# Altium project SCB.PrjPCB (part 2 of 8)

## Sheet SCB_CLKs.SchDoc: SCB_CLKs
size A3 portrait; PageSetup: Record=PageOptions|CenterHorizontal=True|CenterVertical=True|PrintScale=1.00|XCorrection=1.00|YCorrection=1.00|PrintKind=1|BorderSize=5000000|LeftOffset=0|BottomOffset=0|Orientation=1|PaperLength=1000|PaperWidth=1000|Scale=100|PaperSource=7|PrintQuality=-4|MediaType=1|DitherType=10|PaperKind=A4|PrintScaleMode=1; Revision: 3.4; SheetNumber: 3; SheetTotal: 23; Date: 18/06/2014; DrawnBy: J. Gabriel R.E.; Organization: Seven Solutions S.L.; Address1: C/Baza, Parcela 19, Nave 3; Address2: Polígono Ind. Juncaril; Address3: 18210-Peligros-Granada; Address4: Spain; WebAddress: www.sevensols.com; Project: White Rabbit; ProjectName: White Rabbit
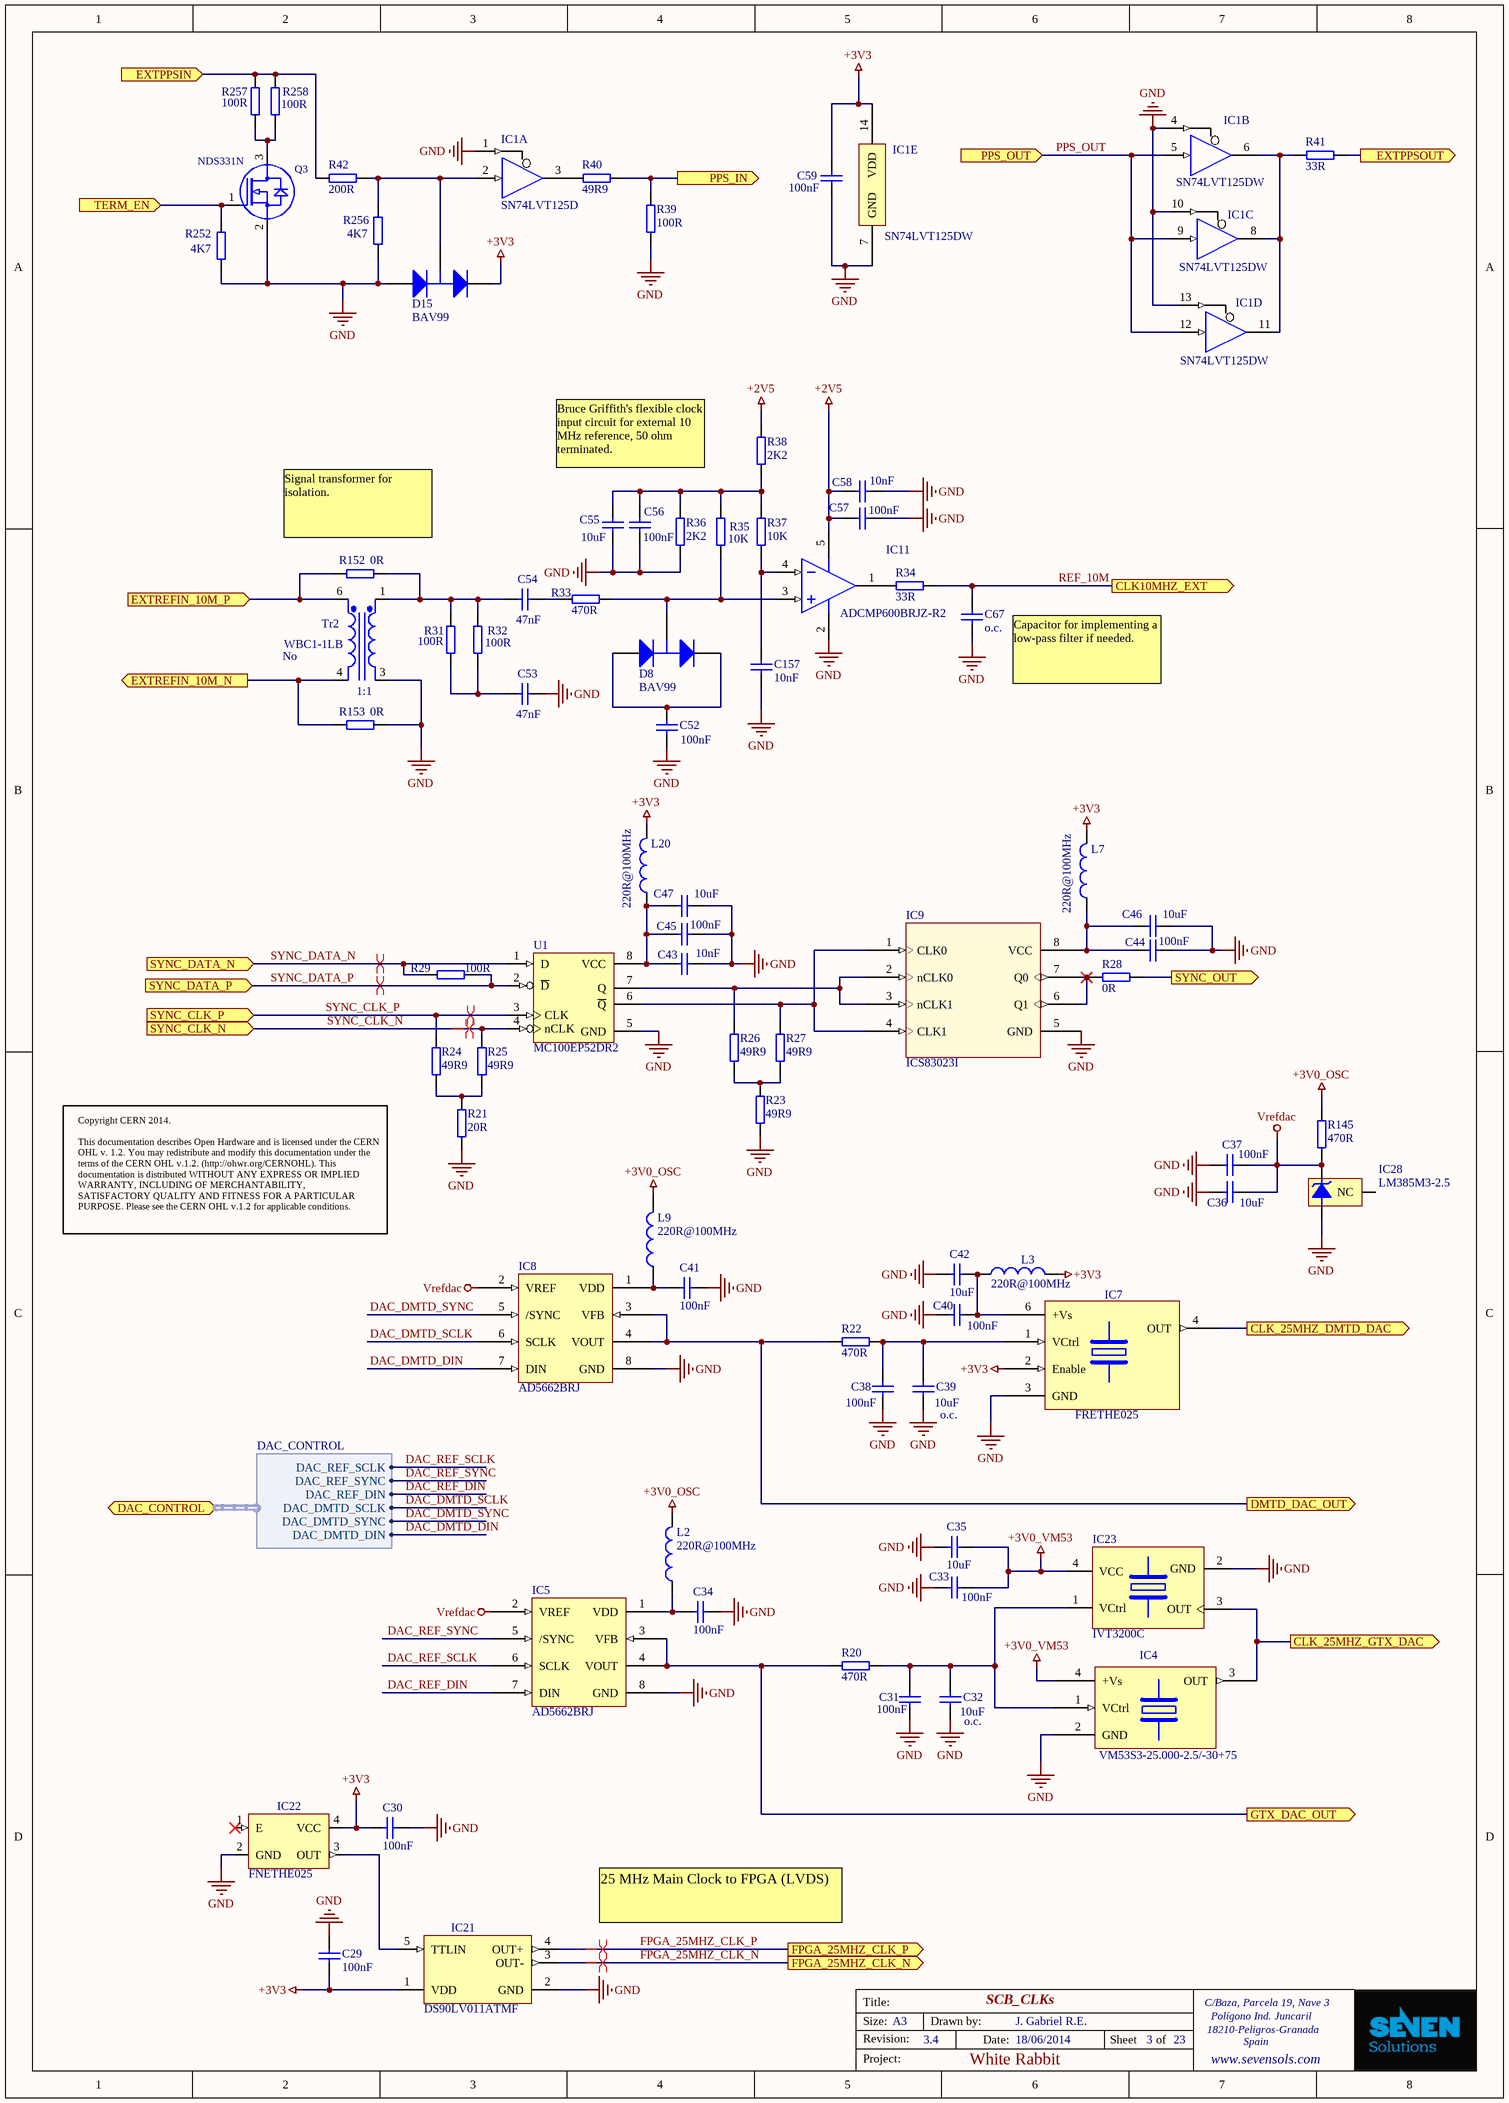
[diagram p5: SCB_CLKs.SchDoc]

### Parts
C29  100nF  [CC1005-0402]
C30  100nF  [CC1005-0402]
C31  100nF  [CC1005-0402]
C32  10uF  value o.c.  [CC1608-0603]
C33  100nF  [CC1005-0402]
C34  100nF  [CC1005-0402]
C35  10uF  [CC1608-0603]
C36  10uF  [CC1608-0603]
C37  100nF  [CC1005-0402]
C38  100nF  [CC1005-0402]
C39  10uF  value o.c.  [CC1608-0603]
C40  100nF  [CC1005-0402]
C41  100nF  [CC1005-0402]
C42  10uF  [CC1608-0603]
C43  10nF  [CC1005-0402]
C44  100nF  [CC1005-0402]
C45  100nF  [CC1005-0402]
C46  10uF  [CC1608-0603]
C47  10uF  [CC1608-0603]
C52  100nF  [CC1005-0402]
C53  47nF  [CC1005-0402]
C54  47nF  [CC1005-0402]
C55  10uF  [CC1608-0603]
C56  100nF  [CC1005-0402]
C57  100nF  [CC1005-0402]
C58  10nF  [CC1005-0402]
C59  100nF  [CC1005-0402]
C67  o.c.  [CC1608-0603]
C157  10nF  [CC1005-0402]
D8  BAV99  [SOT-23]
D15  BAV99  [SOT-23]
IC1  SN74LVT125D  [SO-14]  (parts A,B,C,D,E of 5)
IC4  VM53S3-25.000-2.5/-30+75  [VCTCXO_VM53S]
IC5  value AD5662BRJ  [SOT23-8]  (hidden comment: AD5662B)
IC7  FRETHE025  [vs-705]
IC8  value AD5662BRJ  [SOT23-8]  (hidden comment: AD5662B)
IC9  ICS83023I  [SOIC127P600X175-8N]
IC11  ADCMP600BRJZ-R2  [SOT23-5AL]
IC21  DS90LV011ATMF  [MF05A_N]
IC22  FNETHE025  [SPXO]
IC23  IVT3200C  [OSC_RAKON_IVT3200C]
IC28  LM385M3-2.5  [MF03A_N]
L2  Impedance: 220R@100MHz  [0603]  (hidden comment: 220R@100MHz Ferrite Bead)
L3  Impedance: 220R@100MHz  [0603]  (hidden comment: 220R@100MHz Ferrite Bead)
L7  Impedance: 220R@100MHz  [0603]  (hidden comment: 220R@100MHz Ferrite Bead)
L9  Impedance: 220R@100MHz  [0603]  (hidden comment: 220R@100MHz Ferrite Bead)
L20  Impedance: 220R@100MHz  [0603]  (hidden comment: 220R@100MHz Ferrite Bead)
Q3  NDS331N  [SOT23-3]
R20  470R  [0402]
R21  20R  [0603]
R22  470R  [0402]
R23  49R9  [0402]
R24  49R9  [0402]
R25  49R9  [0402]
R26  49R9  [0402]
R27  49R9  [0402]
R28  value 0R  [0402]  (hidden comment: Jumper)
R29  100R  [0402]
R31  100R  [0805]
R32  100R  [0805]
R33  470R  [0402]
R34  33R  [0603]
R35  10k  [0402]
R36  2K2  [0402]
R37  10k  [0402]
R38  2K2  [0402]
R39  100R  [0402]
R40  49R9  [0603]
R41  33R  [0603]
R42  200R  [0402]
R145  470R  [0402]
R152  value 0R  [0402]  (hidden comment: Jumper)
R153  value 0R  [0402]  (hidden comment: Jumper)
R252  4K7  [0402]
R256  4K7  [0402]
R257  100R  [0805]
R258  100R  [0805]
Tr2  WBC1-1LB  value 1:1  Mounted: No  [SMT6P150P]
U1  MC100EP52DR2  [TSOP65P490-8AN]

### Ports
CLK10MHZ_EXT (out), CLK_25MHZ_DMTD_DAC (out), CLK_25MHZ_GTX_DAC (out), DAC_CONTROL (harness DAC_CONTROL), DMTD_DAC_OUT (out), EXTPPSIN (in), EXTPPSOUT (out), EXTREFIN_10M_N (out), EXTREFIN_10M_P (in), FPGA_25MHZ_CLK_N (out), FPGA_25MHZ_CLK_P (out), GTX_DAC_OUT (out), PPS_IN (out), PPS_OUT (in), SYNC_CLK_N (in), SYNC_CLK_P (in), SYNC_DATA_N (in), SYNC_DATA_P (in), SYNC_OUT (out), TERM_EN (in)

### Harnesses
DAC_CONTROL: DAC_DMTD_DIN, DAC_DMTD_SYNC, DAC_DMTD_SCLK, DAC_REF_DIN, DAC_REF_SYNC, DAC_REF_SCLK

### Nets
+2V5: C57.2 C58.2 IC11.5(VCC/VCCO) R38.2
+3V0_OSC: L2.2 L9.2 R145.2
+3V0_VM53: C33.1 C35.1 IC4.4(+Vs) IC23.4(VCC)
+3V3: C29.2 C30.2 C59.2 D15.2(K) IC1.14(VDD) IC7.2(Enable) IC21.1(VDD) IC22.4(VCC) L3.2 L7.2 L20.2
GND: C29.1 C30.1 C31.1 C32.1 C33.2 C34.1 C35.2 C36.1 C37.2 C38.1 C39.1 C40.2 C41.1 C42.2 C43.2 C44.1 C45.1 C46.1 C47.1 C52.1 C53.2 C55.1 C56.1 C57.1 C58.1 C59.1 C67.1 C157.2 D15.1(A) IC1.1(~{A}) IC1.4(~{A}) IC1.7(GND) IC1.10(~{A}) IC1.13(~{A}) IC4.2(GND) IC5.8(GND) IC7.3(GND) IC8.8(GND) IC9.5(GND) IC11.2(VEE) IC21.2(GND) IC22.2(GND) IC23.2(GND) IC28.2(-V) Q3.2(SOURCE) R21.1 R23.2 R36.1 R39.1 R153.1 R252.2 R256.2 Tr2.3(Sec-) U1.5(GND)
Vrefdac: C36.2 C37.1 IC5.2(VREF) IC8.2(VREF) IC28.1(+V) R145.1
DAC_DMTD_DIN: IC8.7(DIN) ; port DAC_CONTROL.DAC_DMTD_DIN  [project net DAC_CONTROL.DAC_DMTD_DIN]
DAC_DMTD_SCLK: IC8.6(SCLK) ; port DAC_CONTROL.DAC_DMTD_SCLK  [project net DAC_CONTROL.DAC_DMTD_SCLK]
DAC_DMTD_SYNC: IC8.5(/SYNC) ; port DAC_CONTROL.DAC_DMTD_SYNC  [project net DAC_CONTROL.DAC_DMTD_SYNC]
DAC_REF_DIN: IC5.7(DIN) ; port DAC_CONTROL.DAC_REF_DIN  [project net DAC_CONTROL.DAC_REF_DIN]
DAC_REF_SCLK: IC5.6(SCLK) ; port DAC_CONTROL.DAC_REF_SCLK  [project net DAC_CONTROL.DAC_REF_SCLK]
DAC_REF_SYNC: IC5.5(/SYNC) ; port DAC_CONTROL.DAC_REF_SYNC  [project net DAC_CONTROL.DAC_REF_SYNC]
EXTREFIN_10M_N: R153.2 Tr2.4(Pri-) ; port EXTREFIN_10M_N
EXTREFIN_10M_P: R152.2 Tr2.6(Pri+) ; port EXTREFIN_10M_P
FPGA_25MHZ_CLK_N: IC21.3(OUT-) ; port FPGA_25MHZ_CLK_N
FPGA_25MHZ_CLK_P: IC21.4(OUT+) ; port FPGA_25MHZ_CLK_P
PPS_OUT: IC1.5(B) IC1.9(B) IC1.12(B) ; port PPS_OUT
REF_10M: C67.2 R34.2 ; port CLK10MHZ_EXT  [project net CLK10MHZ_EXT]
SYNC_CLK_N: R25.1 U1.4(nCLK) ; port SYNC_CLK_N
SYNC_CLK_P: R24.1 U1.3(CLK) ; port SYNC_CLK_P
SYNC_DATA_N: R29.1 U1.1(D) ; port SYNC_DATA_N
SYNC_DATA_P: R29.2 U1.2(~{D}) ; port SYNC_DATA_P
NetC31_2: C31.2 C32.2 IC4.1(VCtrl) IC23.1(VCtrl) R20.2
NetC34_2: C34.2 IC5.1(VDD) L2.1
NetC38_2: C38.2 C39.2 IC7.1(VCtrl) R22.2
NetC40_1: C40.1 C42.1 IC7.6(+Vs) L3.1
NetC41_2: C41.2 IC8.1(VDD) L9.1
NetC43_1: C43.1 C45.2 C47.2 L20.1 U1.8(VCC)
NetC44_2: C44.2 C46.2 IC9.8(VCC) L7.1
NetC52_2: C52.2 D8.1(A) D8.2(K)
NetC53_1: C53.1 R31.1 R32.1
NetC54_1: C54.1 R31.2 R32.2 R152.1 Tr2.1(Sec+)
NetC54_2: C54.2 R33.1
NetC55_2: C55.2 C56.2 R35.2 R36.2 R37.2 R38.1
NetC154_2: IC7.4(OUT) ; port CLK_25MHZ_DMTD_DAC
NetC157_1: C157.1 IC11.4(VN) R37.1
NetC185_1: IC4.3(OUT) IC23.3(OUT) ; port CLK_25MHZ_GTX_DAC
NetD8_3: D8.3(C) IC11.3(VP) R33.2 R35.1
NetD15_3: D15.3(C) IC1.2(B) R42.1 R256.1
NetIC1_3: IC1.3(Y) R40.1
NetIC1_6: IC1.6(Y) IC1.8(Y) IC1.11(Y) R41.1
NetIC5_3: IC5.3(VFB) IC5.4(VOUT) R20.1 ; port GTX_DAC_OUT
NetIC8_3: IC8.3(VFB) IC8.4(VOUT) R22.1 ; port DMTD_DAC_OUT
NetIC9_1: IC9.1(CLK0) IC9.4(CLK1) R27.1 U1.6(~{Q})
NetIC9_2: IC9.2(nCLK0) IC9.3(nCLK1) R26.1 U1.7(Q)
NetIC9_6: IC9.6(Q1) IC9.7(Q0) R28.1
NetIC11_1: IC11.1(Q) R34.1
NetIC21_5: IC21.5(TTLIN) IC22.3(OUT)
NetIC33_AL34: Q3.1(GATE) R252.1 ; port TERM_EN
NetIC33_J25: R39.2 R40.2 ; port PPS_IN
NetP1_1: R42.2 R257.2 R258.2 ; port EXTPPSIN
NetP3_1: R28.2 ; port SYNC_OUT
NetP4_1: R41.2 ; port EXTPPSOUT
NetQ3_3: Q3.3(DRAIN) R257.1 R258.1
NetR21_2: R21.2 R24.2 R25.2
NetR23_1: R23.1 R26.2 R27.2

Not connected (* = marked no-connect by the designer): IC22 1(E)*; IC28 3(NC)

### Layout directives
differential pair: FPGA_25MHZ_CLK_N, FPGA_25MHZ_CLK_P, SYNC_CLK_N, SYNC_CLK_P, SYNC_DATA_N, SYNC_DATA_P

### Notes on the sheet
- Bruce Griffith's flexible clock input circuit for external 10 MHz reference, 50 ohm terminated.
- (near R152) Signal transformer for isolation.
- (near C67) Capacitor for implementing a low-pass filter if needed.
- Copyright CERN 2014.
  This documentation describes Open Hardware and is licensed under the CERN OHL v. 1.2. You may redistribute and modify this documentation under the terms of the CERN OHL v.1.2. (http://ohwr.org/CERNOHL). This documentation is distributed WITHOUT ANY EXPRESS OR IMPLIED WARRANTY, INCLUDING OF MERCHANTABILITY, SATISFACTORY QUALITY AND FITNESS FOR A PARTICULAR PURPOSE. Please see the CERN OHL v.1.2 for applicable conditions.
- 25 MHz Main Clock to FPGA (LVDS)
- Title:
- Size:
- Revision:
- A3
- Drawn by:
- Date:
- Sheet
- of
- Project:

### Library data of the parts
C29-C31 C33 C34 C37 C38 C40 C41 C44 C45 C52 C56 C57 C59 = CC0402_100NF_16V_10%_X7R: Capacitor; Manufacturer1: TDK; Manufacturer1 PN: C1005X7R1C104K; TC: X7R; Tolerance: ±10%; Voltage: 16V; Published: 8-Jun-2000; LatestRevisionDate: 17-Jul-2002; LatestRevisionNote: Re-released for DXP Platform.; PackageReference: RAD-0.3; Publisher: Altium Limited; Distributor1: Digikey; Distributor1 PN: 445-4952-1-ND; Case: 0402; Value: 100nF
C32 C39 = CC0603_10UF_6.3V_20%_X5R: Capacitor; Manufacturer1: TDK; Manufacturer1 PN: C1608X5R0J106M; TC: X5R; Tolerance: ±20%; Voltage: 6.3V; Mounted: No; Published: 8-Jun-2000; LatestRevisionDate: 17-Jul-2002; LatestRevisionNote: Re-released for DXP Platform.; PackageReference: RAD-0.3; Publisher: Altium Limited; Distributor1: Digikey; Distributor1 PN: 445-4112-1-ND; Case: 0603
C35 C36 C42 C46 C47 C55 = CC0603_10UF_6.3V_20%_X5R: Capacitor; Manufacturer1: TDK; Manufacturer1 PN: C1608X5R0J106M; TC: X5R; Tolerance: ±20%; Voltage: 6.3V; Published: 8-Jun-2000; LatestRevisionDate: 17-Jul-2002; LatestRevisionNote: Re-released for DXP Platform.; PackageReference: RAD-0.3; Publisher: Altium Limited; Distributor1: Digikey; Distributor1 PN: 445-4112-1-ND; Case: 0603; Value: 10uF
C43 C58 C157 = CC0402_10NF_25V_10%_X7R: Capacitor; Manufacturer1: TDK; Manufacturer1 PN: C1005X7R1E103K; TC: X7R; Tolerance: ±10%; Voltage: 25V; Published: 8-Jun-2000; LatestRevisionDate: 17-Jul-2002; LatestRevisionNote: Re-released for DXP Platform.; PackageReference: RAD-0.3; Publisher: Altium Limited; Distributor1: Digikey; Distributor1 PN: 445-1260-1-ND; Case: 0402; Value: 10nF
C53 C54 = CC0402_47NF_25V_10%_X7R: Capacitor; Manufacturer1: TDK; Manufacturer1 PN: C1005X7R1E473K; TC: X7R; Tolerance: ±10%; Voltage: 25V; Published: 8-Jun-2000; LatestRevisionDate: 17-Jul-2002; LatestRevisionNote: Re-released for DXP Platform.; PackageReference: RAD-0.3; Publisher: Altium Limited; Distributor1: Digikey; Distributor1 PN: 445-4941-1-ND; Case: 0402; Value: 47nF
C67 = CC0603_O.C.: Capacitor; Manufacturer1: Phycomp; TC: X7R; Tolerance: ±10%; Voltage: 16V; Mounted: No; Published: 8-Jun-2000; LatestRevisionDate: 17-Jul-2002; LatestRevisionNote: Re-released for DXP Platform.; PackageReference: RAD-0.3; Publisher: Altium Limited; Manufacturer1 PN: *; Distributor1: Digikey; Distributor1 PN: *; Case: 0402; Value: o.c.
D8 D15 = BAV99: Silicon Switching Diode Array for High-Speed Switching; RefId: 1081211; Published: 21-Mar-2003; DatasheetDocument: Oct-1999; PackageDocument: Sep-2001; PackageReference: SOT-23; Publisher: Altium Limited; ComponentLink1Description: Manufacturer Link; ComponentLink1URL: http://www.infineon.com/; ComponentLink2Description: Datasheet; ComponentLink2URL: http://www.infineon.com/upload/Document/cmc_upload/documents/080/631/bav99series_1.pdf; Supplier: Farnell; Value: BAV99
IC1 = SN74LVT125: Quad Buffer with 3-State Outputs with TTL Compatible Inputs; Value: SN74LVT125D; Distributor1 PN: 9592849; Distributor1: Farnell
IC4 = VCTCXO_VM53S: VCTCXO oscillator; Manufacturer1: MEC; Distributor1: RS; Distributor1 PN: 672-0797
IC5 IC8 = AD5662BRJ: Analog Devices 16-bit DAC w/SPI interface, ext ref; RefId: AD5662BRJZ-2REEL7DKR-ND; Supplier: Digikey
IC7 = VCXO_CFPV_45: VCXO oscillator; Manufacturer: Pericom; Distributor1: Digikey; Distributor1 PN: FRETHE025-ND; Manufacturer PN: FRETHE025
IC9 = ICS83023I: 350MHz Differential-to-LVCMOS Translator/Buffer; Manufacturer1 PN: ICS83023AMILF; Manufacturer1: IDT; Distributor1: Digikey; Distributor1 PN: 800-1102-5-ND
IC11 = ADCMP600: Analog Devices fast comparator; Distributor1: Digikey; Distributor1 PN: ADCMP600BRJZ-REEL7CT-ND; Manufacturer1 PN: ADCMP600BRJZ-R2; Manufacturer1: Analog Devices
IC21 = DS90LV011ATMF: Single High Speed Differential Driver; Manufacturer: National Semiconductor; CompType: Interface IC; PackageTopMarking: N01*XTT; PowerWise: N; Published: 4-Dec-2008; DatasheetVersion: May-2002; PackageVersion: revD, Aug-2008; PackageReference: MF05A; Publisher: Altium Limited; PackageDescription: Molded SOT-23, .115 x .063 x .040in Body, 5 Lead, .0375in Pitch; PartNumber: DS90LV011ATMF; RoHS: O; PinCount: 5; DigiKeyPartNumber: DS90LV011ATMFTR-ND; ComponentLink1Description: DS90LV011A Datasheet; ComponentLink1URL: http://www.national.com/ds/DS/DS90LV011A.pdf; ComponentLink2Description: DS90LV011A Web Page; ComponentLink2URL: http://www.national.com/pf/DS/DS90LV011A.html; ComponentLink3Description: MF05A Package Page; ComponentLink3URL: http://www.national.com/packaging/folders/mf05a.html
IC22 = OSC_CFPS-73: SMD oscillator 3.3V (Elfa); Value: FNETHE025; Distributor: Digikey; Distributor PN: FNETHE025CT-ND
IC23 = IVT32000C
IC28 = LM385M3-2.5: Micropower Voltage Reference Diode; Manufacturer: National Semiconductor; CompType: Voltage Reference IC; PackageTopMarking: R12*XTT; Published: 4-Dec-2008; DatasheetVersion: Jan-2008; PackageVersion: revB, Mar-2003; PackageReference: MF03A; Publisher: Altium Limited; PackageDescription: Molded SOT-23, .115 x .051 x .037in Body, 3 Lead, .075 in Pitch; PartNumber: LM385M3-2.5; RoHS: O; PinCount: 3; DigiKeyPartNumber: LM385M3-2.5CT-ND; ComponentLink1Description: LM385-2.5 Datasheet; ComponentLink1URL: http://www.national.com/ds/LM/LM385-2.5.pdf; ComponentLink2Description: LM385-2.5 Web Page; ComponentLink2URL: http://www.national.com/pf/LM/LM385-2.5.html; ComponentLink3Description: MF03A Package Page; ComponentLink3URL: http://www.national.com/packaging/folders/mf03a.html
L2 L3 L7 L9 L20 = L_FERRITE_BEAD: ferrite bead; Manufacturer1: Murata; Manufacturer1 PN: BLM18KG221SN1D; Current Rating: 2.2A; DCR: 50mOhm; Case: 0603; Distributor1: Digikey; Distributor1 PN: 490-5255-1-ND
Q3 = NDS331N: N-Channel Logic Level Enhancement Mode Field Effect Transistor; DEVICE: NDS331N; VALUE: NDS331N; Distributor1 PN: NDS331NCT-ND; Distributor1: Digikey
R20 R22 R33 R145 = R0402_470R_±1%_0.1W_100PPM: SMD Resistor; Manufacturer1: Panasonic; Manufacturer1 PN: ERJ-2RKF4700X; TCR: 100ppm; Power Rating: 0.1W; Tolerance: ±1%; Case: 0402; Distributor1: DigiKey; Distributor1 PN: P470LCT-ND; Value: 470R
R21 = R0603_20R_±1%_0.25W_100PPM: SMD Resistor; Manufacturer1: Vishay; Manufacturer1 PN: CRCW060320R0FKEAHP; TCR: 100ppm; Power Rating: 0.25W; Tolerance: ±1%; Case: 0603; Distributor1: DigiKey; Distributor1 PN: 541-20.0SCT-ND; Value: 20R
R23-R27 = R0402_49R9_±1%_0.1W_100PPM: SMD Resistor; Manufacturer1: Panasonic; Manufacturer1 PN: ERJ-2RKF49R9X; TCR: 100ppm; Power Rating: 0.1W; Tolerance: ±1%; Case: 0402; Distributor1: DigiKey; Distributor1 PN: P49.9LCT-ND; Value: 49R9
R28 R152 R153 = R0402_0R_0.1W_JUMPER: SMD Resistor; Manufacturer1: Panasonic; Manufacturer1 PN: ERJ-2GE0R00X; TCR: 100ppm; Power Rating: 0.1W; Case: 0402; Distributor1: DigiKey; Distributor1 PN: P0.0JCT-ND; Tolerance: Jumper
R29 R39 = R0402_100R_±1%_0.1W_100PPM: SMD Resistor; Manufacturer1: Panasonic; Manufacturer1 PN: ERJ-2RKF1000X; TCR: 100ppm; Power Rating: 0.1W; Tolerance: ±1%; Case: 0402; Distributor1: DigiKey; Distributor1 PN: P100LCT-ND; Value: 100R
R31 R32 R257 R258 = R0805_100R_±1%_0.33W_100PPM: SMD Resistor; Manufacturer1: Vishay Dale; Manufacturer1 PN: CRCW0805100RFKEAHP; TCR: 100ppm; Power Rating: 0.33W; Tolerance: ±1%; Case: 0805; Distributor1: DigiKey; Distributor1 PN: 541-100TCT-ND; Value: 100R
R34 R41 = R0603_33R_±1%_0.25W_100PPM: SMD Resistor; Manufacturer1: Vishay/Dale; Manufacturer1 PN: CRCW060333R0FKEAHP; TCR: 100ppm; Power Rating: 0.25W; Tolerance: ±1%; Distributor1: DigiKey; Distributor1 PN: 541-33.0SCT-ND; Value: 33R
  R34: Case: 0603
  R41: Case: 0402
R35 R37 = R0402_10K_±1%_0.1W_100PPM: SMD Resistor; Manufacturer1: Panasonic; Manufacturer1 PN: ERJ-2RKF1002X; TCR: 100ppm; Power Rating: 0.1W; Tolerance: ±1%; Case: 0402; Distributor1: DigiKey; Distributor1 PN: P10.0KLCT-ND; Value: 10K
R36 R38 = R0402_2K2_±1%_0.1W_100PPM: SMD Resistor; Manufacturer1: Panasonic; Manufacturer1 PN: ERJ-2RKF2201X; TCR: 100ppm; Power Rating: 0.1W; Tolerance: ±1%; Case: 0402; Distributor1: DigiKey; Distributor1 PN: P2.20KLCT-ND; Value: 2K2
R40 = R0603_49R9_±1%_0.25W_100PPM: SMD Resistor; Manufacturer1: Vishay/Dale; Manufacturer1 PN: CRCW060349R9FKEAHP; TCR: 100ppm; Power Rating: 0.25W; Tolerance: ±1%; Case: 0603; Distributor1: DigiKey; Distributor1 PN: 541-49.9SCT-ND; Value: 49R9
R42 = R0402_200R_±1%_0.1W_100PPM: SMD Resistor; Manufacturer1: Panasonic; Manufacturer1 PN: ERJ-2RKF2000X; TCR: 100ppm; Power Rating: 0.1W; Tolerance: ±1%; Case: 0402; Distributor1: DigiKey; Distributor1 PN: P200LCT-ND; Value: 200R
R252 R256 = R0402_4.7K_±1%_0.1W_100PPM: SMD Resistor; Manufacturer1: Panasonic; Manufacturer1 PN: ERJ-2RKF4701X; TCR: 100ppm; Power Rating: 0.1W; Tolerance: ±1%; Case: 0402; Distributor1: DigiKey; Distributor1 PN: ERJ-2RKF4701X; Value: 4K7
Tr2 = WBC1-1LB: SMT Mini WideBand Transformer 1:1, 10uH,; Manufacturer: Coilcraft; Published: 8-Jun-2000; LatestRevisionDate: 17-Jul-2002; LatestRevisionNote: Re-released for DXP Platform.; PackageReference: TRF_4; Publisher: Altium Limited; Manufacturer PN: WBC1-1LB
U1 = MC100EP52DR2: Differential Data and Clock D-Type Flip-Flop; Manufacturer1: On Semiconductors; Manufacturer1 PN: MC100EP52DTG; Distributor1: Digikey; Distributor1 PN: MC100EP52DTGOS-ND

## Sheet FPGA_GTX.SchDoc: FPGA_GTX
size A3; Date: 18/06/2014; DrawnBy: J. Gabriel R.E.; Organization: Seven Solutions S.L.; Address1: C/Baza, Parcela 19, Nave 3; Address2: Polígono Ind. Juncaril; Address3: 18210-Peligros-Granada; Address4: Spain; Revision: 3.4; SheetNumber: 7; SheetTotal: 23; WebAddress: www.sevensols.com; Project: White Rabbit; ProjectName: Project Name
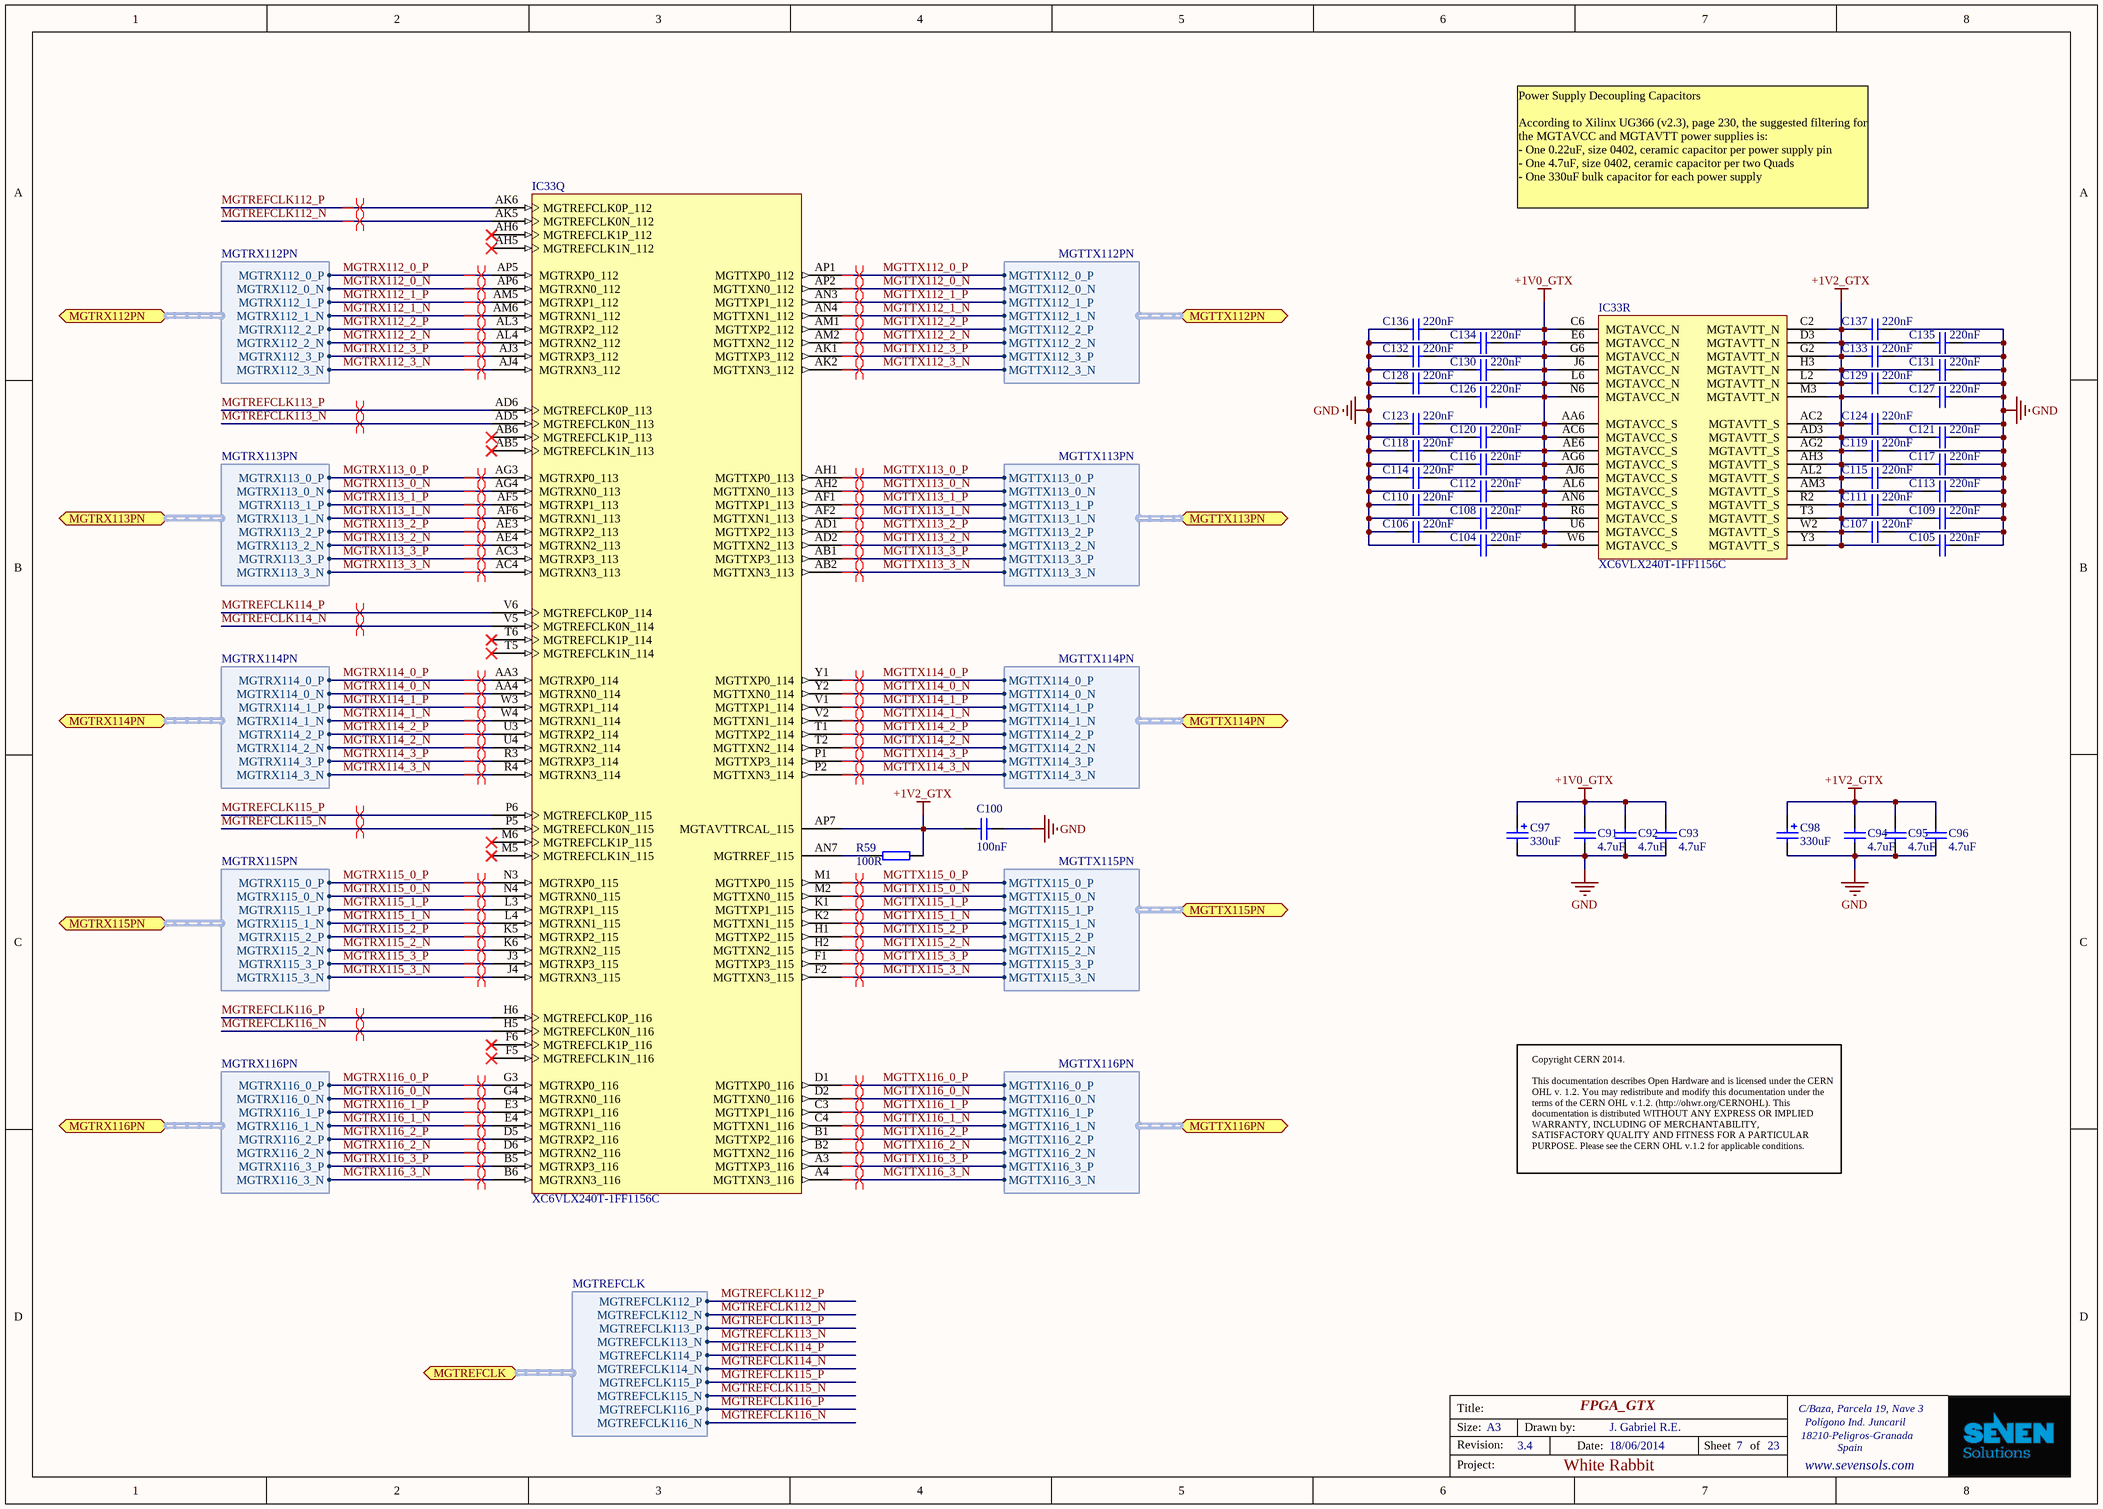
[diagram p6: FPGA_GTX.SchDoc]

### Parts
C91  4.7uF  [CC1608-0603]
C92  4.7uF  [CC1608-0603]
C93  4.7uF  [CC1608-0603]
C94  4.7uF  [CC1608-0603]
C95  4.7uF  [CC1608-0603]
C96  4.7uF  [CC1608-0603]
C97  330uF  [D]
C98  330uF  [D]
C100  100nF  [CC1005-0402]
C104  220nF  [CC1005-0402]
C105  220nF  [CC1005-0402]
C106  220nF  [CC1005-0402]
C107  220nF  [CC1005-0402]
C108  220nF  [CC1005-0402]
C109  220nF  [CC1005-0402]
C110  220nF  [CC1005-0402]
C111  220nF  [CC1005-0402]
C112  220nF  [CC1005-0402]
C113  220nF  [CC1005-0402]
C114  220nF  [CC1005-0402]
C115  220nF  [CC1005-0402]
C116  220nF  [CC1005-0402]
C117  220nF  [CC1005-0402]
C118  220nF  [CC1005-0402]
C119  220nF  [CC1005-0402]
C120  220nF  [CC1005-0402]
C121  220nF  [CC1005-0402]
C123  220nF  [CC1005-0402]
C124  220nF  [CC1005-0402]
C126  220nF  [CC1005-0402]
C127  220nF  [CC1005-0402]
C128  220nF  [CC1005-0402]
C129  220nF  [CC1005-0402]
C130  220nF  [CC1005-0402]
C131  220nF  [CC1005-0402]
C132  220nF  [CC1005-0402]
C133  220nF  [CC1005-0402]
C134  220nF  [CC1005-0402]
C135  220nF  [CC1005-0402]
C136  220nF  [CC1005-0402]
C137  220nF  [CC1005-0402]
IC33  XC6VLX240T-1FF1156C  [FF1156]  (parts Q,R of 20)
R59  100R  [0402]

### Ports
MGTREFCLK (harness MGTREFCLK), MGTRX112PN (harness MGTRX112PN), MGTRX113PN (harness MGTRX113PN), MGTRX114PN (harness MGTRX114PN), MGTRX115PN (harness MGTRX115PN), MGTRX116PN (harness MGTRX116PN), MGTTX112PN (harness MGTTX112PN), MGTTX113PN (harness MGTTX113PN), MGTTX114PN (harness MGTTX114PN), MGTTX115PN (harness MGTTX115PN), MGTTX116PN (harness MGTTX116PN)

### Harnesses
MGTREFCLK: MGTREFCLK112_P, MGTREFCLK112_N, MGTREFCLK113_P, MGTREFCLK113_N, MGTREFCLK114_P, MGTREFCLK114_N, MGTREFCLK115_P, MGTREFCLK115_N, MGTREFCLK116_P, MGTREFCLK116_N
MGTRX116PN: MGTRX116_0_P, MGTRX116_0_N, MGTRX116_1_P, MGTRX116_1_N, MGTRX116_2_P, MGTRX116_2_N, MGTRX116_3_P, MGTRX116_3_N
MGTRX115PN: MGTRX115_0_P, MGTRX115_0_N, MGTRX115_1_P, MGTRX115_1_N, MGTRX115_2_P, MGTRX115_2_N, MGTRX115_3_P, MGTRX115_3_N
MGTRX114PN: MGTRX114_0_P, MGTRX114_0_N, MGTRX114_1_P, MGTRX114_1_N, MGTRX114_2_P, MGTRX114_2_N, MGTRX114_3_P, MGTRX114_3_N
MGTRX113PN: MGTRX113_0_P, MGTRX113_0_N, MGTRX113_1_P, MGTRX113_1_N, MGTRX113_2_P, MGTRX113_2_N, MGTRX113_3_P, MGTRX113_3_N
MGTRX112PN: MGTRX112_0_P, MGTRX112_0_N, MGTRX112_1_P, MGTRX112_1_N, MGTRX112_2_P, MGTRX112_2_N, MGTRX112_3_P, MGTRX112_3_N
MGTTX112PN: MGTTX112_0_P, MGTTX112_0_N, MGTTX112_1_P, MGTTX112_1_N, MGTTX112_2_P, MGTTX112_2_N, MGTTX112_3_P, MGTTX112_3_N
MGTTX113PN: MGTTX113_0_P, MGTTX113_0_N, MGTTX113_1_P, MGTTX113_1_N, MGTTX113_2_P, MGTTX113_2_N, MGTTX113_3_P, MGTTX113_3_N
MGTTX114PN: MGTTX114_0_P, MGTTX114_0_N, MGTTX114_1_P, MGTTX114_1_N, MGTTX114_2_P, MGTTX114_2_N, MGTTX114_3_P, MGTTX114_3_N
MGTTX115PN: MGTTX115_0_P, MGTTX115_0_N, MGTTX115_1_P, MGTTX115_1_N, MGTTX115_2_P, MGTTX115_2_N, MGTTX115_3_P, MGTTX115_3_N
MGTTX116PN: MGTTX116_0_P, MGTTX116_0_N, MGTTX116_1_P, MGTTX116_1_N, MGTTX116_2_P, MGTTX116_2_N, MGTTX116_3_P, MGTTX116_3_N

### Nets
+1V0_GTX: C91.2 C92.2 C93.2 C97.1 C104.2 C106.2 C108.2 C110.2 C112.2 C114.2 C116.2 C118.2 C120.2 C123.2 C126.2 C128.2 C130.2 C132.2 C134.2 C136.2 IC33.AA6(MGTAVCC_S) IC33.AC6(MGTAVCC_S) IC33.AE6(MGTAVCC_S) IC33.AG6(MGTAVCC_S) IC33.AJ6(MGTAVCC_S) IC33.AL6(MGTAVCC_S) IC33.AN6(MGTAVCC_S) IC33.C6(MGTAVCC_N) IC33.E6(MGTAVCC_N) IC33.G6(MGTAVCC_N) IC33.J6(MGTAVCC_N) IC33.L6(MGTAVCC_N) IC33.N6(MGTAVCC_N) IC33.R6(MGTAVCC_S) IC33.U6(MGTAVCC_S) IC33.W6(MGTAVCC_S)
+1V2_GTX: C94.2 C95.2 C96.2 C98.1 C100.2 C105.1 C107.1 C109.1 C111.1 C113.1 C115.1 C117.1 C119.1 C121.1 C124.1 C127.1 C129.1 C131.1 C133.1 C135.1 C137.1 IC33.AC2(MGTAVTT_S) IC33.AD3(MGTAVTT_S) IC33.AG2(MGTAVTT_S) IC33.AH3(MGTAVTT_S) IC33.AL2(MGTAVTT_S) IC33.AM3(MGTAVTT_S) IC33.AP7(MGTAVTTRCAL_115) IC33.C2(MGTAVTT_N) IC33.D3(MGTAVTT_N) IC33.G2(MGTAVTT_N) IC33.H3(MGTAVTT_N) IC33.L2(MGTAVTT_N) IC33.M3(MGTAVTT_N) IC33.R2(MGTAVTT_S) IC33.T3(MGTAVTT_S) IC33.W2(MGTAVTT_S) IC33.Y3(MGTAVTT_S) R59.1
GND: C91.1 C92.1 C93.1 C94.1 C95.1 C96.1 C97.2 C98.2 C100.1 C104.1 C105.2 C106.1 C107.2 C108.1 C109.2 C110.1 C111.2 C112.1 C113.2 C114.1 C115.2 C116.1 C117.2 C118.1 C119.2 C120.1 C121.2 C123.1 C124.2 C126.1 C127.2 C128.1 C129.2 C130.1 C131.2 C132.1 C133.2 C134.1 C135.2 C136.1 C137.2
MGTREFCLK112_N: IC33.AK5(MGTREFCLK0N_112) ; port MGTREFCLK.MGTREFCLK112_N  [project net MGTREFCLK.MGTREFCLK112_N]
MGTREFCLK112_P: IC33.AK6(MGTREFCLK0P_112) ; port MGTREFCLK.MGTREFCLK112_P  [project net MGTREFCLK.MGTREFCLK112_P]
MGTREFCLK113_N: IC33.AD5(MGTREFCLK0N_113) ; port MGTREFCLK.MGTREFCLK113_N  [project net MGTREFCLK.MGTREFCLK113_N]
MGTREFCLK113_P: IC33.AD6(MGTREFCLK0P_113) ; port MGTREFCLK.MGTREFCLK113_P  [project net MGTREFCLK.MGTREFCLK113_P]
MGTREFCLK114_N: IC33.V5(MGTREFCLK0N_114) ; port MGTREFCLK.MGTREFCLK114_N  [project net MGTREFCLK.MGTREFCLK114_N]
MGTREFCLK114_P: IC33.V6(MGTREFCLK0P_114) ; port MGTREFCLK.MGTREFCLK114_P  [project net MGTREFCLK.MGTREFCLK114_P]
MGTREFCLK115_N: IC33.P5(MGTREFCLK0N_115) ; port MGTREFCLK.MGTREFCLK115_N  [project net MGTREFCLK.MGTREFCLK115_N]
MGTREFCLK115_P: IC33.P6(MGTREFCLK0P_115) ; port MGTREFCLK.MGTREFCLK115_P  [project net MGTREFCLK.MGTREFCLK115_P]
MGTREFCLK116_N: IC33.H5(MGTREFCLK0N_116) ; port MGTREFCLK.MGTREFCLK116_N  [project net MGTREFCLK.MGTREFCLK116_N]
MGTREFCLK116_P: IC33.H6(MGTREFCLK0P_116) ; port MGTREFCLK.MGTREFCLK116_P  [project net MGTREFCLK.MGTREFCLK116_P]
MGTRX112_0_N: IC33.AP6(MGTRXN0_112) ; port MGTRX112PN.MGTRX112_0_N
MGTRX112_0_P: IC33.AP5(MGTRXP0_112) ; port MGTRX112PN.MGTRX112_0_P
MGTRX112_1_N: IC33.AM6(MGTRXN1_112) ; port MGTRX112PN.MGTRX112_1_N
MGTRX112_1_P: IC33.AM5(MGTRXP1_112) ; port MGTRX112PN.MGTRX112_1_P
MGTRX112_2_N: IC33.AL4(MGTRXN2_112) ; port MGTRX112PN.MGTRX112_2_N
MGTRX112_2_P: IC33.AL3(MGTRXP2_112) ; port MGTRX112PN.MGTRX112_2_P
MGTRX112_3_N: IC33.AJ4(MGTRXN3_112) ; port MGTRX112PN.MGTRX112_3_N
MGTRX112_3_P: IC33.AJ3(MGTRXP3_112) ; port MGTRX112PN.MGTRX112_3_P
MGTRX113_0_N: IC33.AG4(MGTRXN0_113) ; port MGTRX113PN.MGTRX113_0_N
MGTRX113_0_P: IC33.AG3(MGTRXP0_113) ; port MGTRX113PN.MGTRX113_0_P
MGTRX113_1_N: IC33.AF6(MGTRXN1_113) ; port MGTRX113PN.MGTRX113_1_N
MGTRX113_1_P: IC33.AF5(MGTRXP1_113) ; port MGTRX113PN.MGTRX113_1_P
MGTRX113_2_N: IC33.AE4(MGTRXN2_113) ; port MGTRX113PN.MGTRX113_2_N
MGTRX113_2_P: IC33.AE3(MGTRXP2_113) ; port MGTRX113PN.MGTRX113_2_P
MGTRX113_3_N: IC33.AC4(MGTRXN3_113) ; port MGTRX113PN.MGTRX113_3_N
MGTRX113_3_P: IC33.AC3(MGTRXP3_113) ; port MGTRX113PN.MGTRX113_3_P
MGTRX114_0_N: IC33.AA4(MGTRXN0_114) ; port MGTRX114PN.MGTRX114_0_N
MGTRX114_0_P: IC33.AA3(MGTRXP0_114) ; port MGTRX114PN.MGTRX114_0_P
MGTRX114_1_N: IC33.W4(MGTRXN1_114) ; port MGTRX114PN.MGTRX114_1_N
MGTRX114_1_P: IC33.W3(MGTRXP1_114) ; port MGTRX114PN.MGTRX114_1_P
MGTRX114_2_N: IC33.U4(MGTRXN2_114) ; port MGTRX114PN.MGTRX114_2_N
MGTRX114_2_P: IC33.U3(MGTRXP2_114) ; port MGTRX114PN.MGTRX114_2_P
MGTRX114_3_N: IC33.R4(MGTRXN3_114) ; port MGTRX114PN.MGTRX114_3_N
MGTRX114_3_P: IC33.R3(MGTRXP3_114) ; port MGTRX114PN.MGTRX114_3_P
MGTRX115_0_N: IC33.N4(MGTRXN0_115) ; port MGTRX115PN.MGTRX115_0_N
MGTRX115_0_P: IC33.N3(MGTRXP0_115) ; port MGTRX115PN.MGTRX115_0_P
MGTRX115_1_N: IC33.L4(MGTRXN1_115) ; port MGTRX115PN.MGTRX115_1_N
MGTRX115_1_P: IC33.L3(MGTRXP1_115) ; port MGTRX115PN.MGTRX115_1_P
MGTRX115_2_N: IC33.K6(MGTRXN2_115) ; port MGTRX115PN.MGTRX115_2_N
MGTRX115_2_P: IC33.K5(MGTRXP2_115) ; port MGTRX115PN.MGTRX115_2_P
MGTRX115_3_N: IC33.J4(MGTRXN3_115) ; port MGTRX115PN.MGTRX115_3_N
MGTRX115_3_P: IC33.J3(MGTRXP3_115) ; port MGTRX115PN.MGTRX115_3_P
MGTRX116_0_N: IC33.G4(MGTRXN0_116) ; port MGTRX116PN.MGTRX116_0_N
MGTRX116_0_P: IC33.G3(MGTRXP0_116) ; port MGTRX116PN.MGTRX116_0_P
MGTRX116_1_N: IC33.E4(MGTRXN1_116) ; port MGTRX116PN.MGTRX116_1_N
MGTRX116_1_P: IC33.E3(MGTRXP1_116) ; port MGTRX116PN.MGTRX116_1_P
MGTRX116_2_N: IC33.D6(MGTRXN2_116) ; port MGTRX116PN.MGTRX116_2_N
MGTRX116_2_P: IC33.D5(MGTRXP2_116) ; port MGTRX116PN.MGTRX116_2_P
MGTRX116_3_N: IC33.B6(MGTRXN3_116) ; port MGTRX116PN.MGTRX116_3_N
MGTRX116_3_P: IC33.B5(MGTRXP3_116) ; port MGTRX116PN.MGTRX116_3_P
MGTTX112_0_N: IC33.AP2(MGTTXN0_112) ; port MGTTX112PN.MGTTX112_0_N
MGTTX112_0_P: IC33.AP1(MGTTXP0_112) ; port MGTTX112PN.MGTTX112_0_P
MGTTX112_1_N: IC33.AN4(MGTTXN1_112) ; port MGTTX112PN.MGTTX112_1_N
MGTTX112_1_P: IC33.AN3(MGTTXP1_112) ; port MGTTX112PN.MGTTX112_1_P
MGTTX112_2_N: IC33.AM2(MGTTXN2_112) ; port MGTTX112PN.MGTTX112_2_N
MGTTX112_2_P: IC33.AM1(MGTTXP2_112) ; port MGTTX112PN.MGTTX112_2_P
MGTTX112_3_N: IC33.AK2(MGTTXN3_112) ; port MGTTX112PN.MGTTX112_3_N
MGTTX112_3_P: IC33.AK1(MGTTXP3_112) ; port MGTTX112PN.MGTTX112_3_P
MGTTX113_0_N: IC33.AH2(MGTTXN0_113) ; port MGTTX113PN.MGTTX113_0_N
MGTTX113_0_P: IC33.AH1(MGTTXP0_113) ; port MGTTX113PN.MGTTX113_0_P
MGTTX113_1_N: IC33.AF2(MGTTXN1_113) ; port MGTTX113PN.MGTTX113_1_N
MGTTX113_1_P: IC33.AF1(MGTTXP1_113) ; port MGTTX113PN.MGTTX113_1_P
MGTTX113_2_N: IC33.AD2(MGTTXN2_113) ; port MGTTX113PN.MGTTX113_2_N
MGTTX113_2_P: IC33.AD1(MGTTXP2_113) ; port MGTTX113PN.MGTTX113_2_P
MGTTX113_3_N: IC33.AB2(MGTTXN3_113) ; port MGTTX113PN.MGTTX113_3_N
MGTTX113_3_P: IC33.AB1(MGTTXP3_113) ; port MGTTX113PN.MGTTX113_3_P
MGTTX114_0_N: IC33.Y2(MGTTXN0_114) ; port MGTTX114PN.MGTTX114_0_N
MGTTX114_0_P: IC33.Y1(MGTTXP0_114) ; port MGTTX114PN.MGTTX114_0_P
MGTTX114_1_N: IC33.V2(MGTTXN1_114) ; port MGTTX114PN.MGTTX114_1_N
MGTTX114_1_P: IC33.V1(MGTTXP1_114) ; port MGTTX114PN.MGTTX114_1_P
MGTTX114_2_N: IC33.T2(MGTTXN2_114) ; port MGTTX114PN.MGTTX114_2_N
MGTTX114_2_P: IC33.T1(MGTTXP2_114) ; port MGTTX114PN.MGTTX114_2_P
MGTTX114_3_N: IC33.P2(MGTTXN3_114) ; port MGTTX114PN.MGTTX114_3_N
MGTTX114_3_P: IC33.P1(MGTTXP3_114) ; port MGTTX114PN.MGTTX114_3_P
MGTTX115_0_N: IC33.M2(MGTTXN0_115) ; port MGTTX115PN.MGTTX115_0_N
MGTTX115_0_P: IC33.M1(MGTTXP0_115) ; port MGTTX115PN.MGTTX115_0_P
MGTTX115_1_N: IC33.K2(MGTTXN1_115) ; port MGTTX115PN.MGTTX115_1_N
MGTTX115_1_P: IC33.K1(MGTTXP1_115) ; port MGTTX115PN.MGTTX115_1_P
MGTTX115_2_N: IC33.H2(MGTTXN2_115) ; port MGTTX115PN.MGTTX115_2_N
MGTTX115_2_P: IC33.H1(MGTTXP2_115) ; port MGTTX115PN.MGTTX115_2_P
MGTTX115_3_N: IC33.F2(MGTTXN3_115) ; port MGTTX115PN.MGTTX115_3_N
MGTTX115_3_P: IC33.F1(MGTTXP3_115) ; port MGTTX115PN.MGTTX115_3_P
MGTTX116_0_N: IC33.D2(MGTTXN0_116) ; port MGTTX116PN.MGTTX116_0_N
MGTTX116_0_P: IC33.D1(MGTTXP0_116) ; port MGTTX116PN.MGTTX116_0_P
MGTTX116_1_N: IC33.C4(MGTTXN1_116) ; port MGTTX116PN.MGTTX116_1_N
MGTTX116_1_P: IC33.C3(MGTTXP1_116) ; port MGTTX116PN.MGTTX116_1_P
MGTTX116_2_N: IC33.B2(MGTTXN2_116) ; port MGTTX116PN.MGTTX116_2_N
MGTTX116_2_P: IC33.B1(MGTTXP2_116) ; port MGTTX116PN.MGTTX116_2_P
MGTTX116_3_N: IC33.A4(MGTTXN3_116) ; port MGTTX116PN.MGTTX116_3_N
MGTTX116_3_P: IC33.A3(MGTTXP3_116) ; port MGTTX116PN.MGTTX116_3_P
NetIC33_AN7: IC33.AN7(MGTRREF_115) R59.2

Not connected (* = marked no-connect by the designer): IC33 AB5(MGTREFCLK1N_113)* AB6(MGTREFCLK1P_113)* AH5(MGTREFCLK1N_112)* AH6(MGTREFCLK1P_112)* F5(MGTREFCLK1N_116)* F6(MGTREFCLK1P_116)* M5(MGTREFCLK1N_115)* M6(MGTREFCLK1P_115)* T5(MGTREFCLK1N_114)* T6(MGTREFCLK1P_114)*

### Layout directives
differential pair: MGTREFCLK.MGTREFCLK112_N, MGTREFCLK.MGTREFCLK112_P, MGTREFCLK.MGTREFCLK113_N, MGTREFCLK.MGTREFCLK113_P, MGTREFCLK.MGTREFCLK114_N, MGTREFCLK.MGTREFCLK114_P, MGTREFCLK.MGTREFCLK115_N, MGTREFCLK.MGTREFCLK115_P, MGTREFCLK.MGTREFCLK116_N, MGTREFCLK.MGTREFCLK116_P, MGTRX112_0_N, MGTRX112_0_P, MGTRX112_1_N, MGTRX112_1_P, MGTRX112_2_N, MGTRX112_2_P, MGTRX112_3_N, MGTRX112_3_P, MGTRX113_0_N, MGTRX113_0_P, MGTRX113_1_N, MGTRX113_1_P, MGTRX113_2_N, MGTRX113_2_P, MGTRX113_3_N, MGTRX113_3_P, MGTRX114_0_N, MGTRX114_0_P, MGTRX114_1_N, MGTRX114_1_P, MGTRX114_2_N, MGTRX114_2_P, MGTRX114_3_N, MGTRX114_3_P, MGTRX115_0_N, MGTRX115_0_P, MGTRX115_1_N, MGTRX115_1_P, MGTRX115_2_N, MGTRX115_2_P, MGTRX115_3_N, MGTRX115_3_P, MGTRX116_0_N, MGTRX116_0_P, MGTRX116_1_N, MGTRX116_1_P, MGTRX116_2_N, MGTRX116_2_P, MGTRX116_3_N, MGTRX116_3_P, MGTTX112_0_N, MGTTX112_0_P, MGTTX112_1_N, MGTTX112_1_P, MGTTX112_2_N, MGTTX112_2_P, MGTTX112_3_N, MGTTX112_3_P, MGTTX113_0_N, MGTTX113_0_P, MGTTX113_1_N, MGTTX113_1_P, MGTTX113_2_N, MGTTX113_2_P, MGTTX113_3_N, MGTTX113_3_P, MGTTX114_0_N, MGTTX114_0_P, MGTTX114_1_N, MGTTX114_1_P, MGTTX114_2_N, MGTTX114_2_P, MGTTX114_3_N, MGTTX114_3_P, MGTTX115_0_N, MGTTX115_0_P, MGTTX115_1_N, MGTTX115_1_P, MGTTX115_2_N, MGTTX115_2_P, MGTTX115_3_N, MGTTX115_3_P, MGTTX116_0_N, MGTTX116_0_P, MGTTX116_1_N, MGTTX116_1_P, MGTTX116_2_N, MGTTX116_2_P, MGTTX116_3_N, MGTTX116_3_P

### Notes on the sheet
- Power Supply Decoupling Capacitors
  According to Xilinx UG366 (v2.3), page 230, the suggested filtering for the MGTAVCC and MGTAVTT power supplies is:
  - One 0.22uF, size 0402, ceramic capacitor per power supply pin
  - One 4.7uF, size 0402, ceramic capacitor per two Quads
  - One 330uF bulk capacitor for each power supply
- Copyright CERN 2014.
  This documentation describes Open Hardware and is licensed under the CERN OHL v. 1.2. You may redistribute and modify this documentation under the terms of the CERN OHL v.1.2. (http://ohwr.org/CERNOHL). This documentation is distributed WITHOUT ANY EXPRESS OR IMPLIED WARRANTY, INCLUDING OF MERCHANTABILITY, SATISFACTORY QUALITY AND FITNESS FOR A PARTICULAR PURPOSE. Please see the CERN OHL v.1.2 for applicable conditions.
- Title:
- Size:
- Revision:
- A3
- Drawn by:
- Date:
- Sheet
- of
- Project:

### Library data of the parts
C91-C96 = CC0603_4.7UF_10V_10%_X5R: Capacitor; Manufacturer1: TDK; Manufacturer1 PN: C1608X5R1A475K; TC: X5R; Tolerance: ±10%; Voltage: 10V; Published: 8-Jun-2000; LatestRevisionDate: 17-Jul-2002; LatestRevisionNote: Re-released for DXP Platform.; PackageReference: RAD-0.3; Publisher: Altium Limited; Distributor1: Digikey; Distributor1 PN: 445-5170-1-ND; Case: 0603; Value: 4.7uF
C97 C98 = CP2917_330UF_6.3V_20%_TANT: Polarized Capacitor Tantalum; Manufacturer1: Kemet; Manufacturer1 PN: T520D337M006ATE025; Tolerance: ±20%; Voltage: 6.3V; ESR: 25mOhm; Published: 8-Jun-2000; LatestRevisionDate: 17-Jul-2002; LatestRevisionNote: Re-released for DXP Platform.; PackageReference: RB7.6-15; Publisher: Altium Limited; Case: 2917; Distributor1: Digikey; Distributor1 PN: 399-4053-1-ND; TC: Tantalum; Value: 330uF
C100 = CC0402_100NF_16V_10%_X7R: as C29-C31 on sheet SCB_CLKs; Published: 8-Jun-2000; LatestRevisionDate: 17-Jul-2002; LatestRevisionNote: Re-released for DXP Platform.; PackageReference: RAD-0.3; Publisher: Altium Limited; Distributor1: Digikey; Distributor1 PN: 445-4952-1-ND; Case: 0402; Value: 100nF
C104-C121 C123 C124 C126-C137 = CC0402_220NF_16V_10%_X7R: Capacitor; Manufacturer1: TDK; Manufacturer1 PN: C1005X7R1C224K; TC: X7R; Tolerance: ±10%; Voltage: 16V; Published: 8-Jun-2000; LatestRevisionDate: 17-Jul-2002; LatestRevisionNote: Re-released for DXP Platform.; PackageReference: RAD-0.3; Publisher: Altium Limited; Distributor1: Digikey; Distributor1 PN: 445-5936-1-ND; Case: 0402; Value: 220nF
IC33 = XC6VLX130T-1FF1156C: Virtex-6 LXT Platform FPGA, 600 User I/Os, 20 GTXs, 1156-Ball FFBGA, Speed Grade 1, Commercial Grade; FirstPublished: 17-Nov-2009; DatasheetVersion: v2.0, Sep-2009; PackageVersion: ver1.0, Jun-2009; PackageReference: FF1156; Publisher: Altium Limited; PackageDescription: 1156-Ball Flip-Chip Fine Pitch Ball Grid Array (FF1156); Code_JEDEC: MS-034-AAR-1; Code_IPC: BGA100P34X34-1156; ComponentLink1Description: Virtex-6 Datasheet; ComponentLink1URL: http://www.xilinx.com/support/documentation/data_sheets/ds150.pdf; ComponentLink2Description: Pinout Specification; ComponentLink2URL: http://www.xilinx.com/support/packagefiles/virtex-6-pkgs.htm; ComponentLink3Description: FF1156 Package Drawing; ComponentLink3URL: http://www.xilinx.com/support/documentation/package_specs/ff1156.pdf; ComponentLink4Description: Virtex-6 Documents; ComponentLink4URL: http://www.xilinx.com/support/documentation/virtex-6.htm; ComponentLink5Description: Xilinx.com Home; ComponentLink5URL: http://www.xilinx.com
R59 = R0402_100R_±1%_0.1W_100PPM: as R29 on sheet SCB_CLKs; Case: 0402; Distributor1: DigiKey; Distributor1 PN: P100LCT-ND; Value: 100R

## Sheet CPU_100M_Ethernet.SchDoc: CPU_100M_Ethernet
size A3; PageSetup: Record=PageOptions|CenterHorizontal=True|CenterVertical=True|PrintScale=1.42|XCorrection=1.00|YCorrection=1.00|PrintKind=1|BorderSize=5000000|LeftOffset=0|BottomOffset=0|Orientation=2|PaperLength=1000|PaperWidth=1000|Scale=100|PaperSource=7|PrintQuality=-4|MediaType=1|DitherType=10|PaperKind=A3|PrintScaleMode=1; Date: 18/06/2014; DrawnBy: J. Gabriel R.E.; Organization: Seven Solutions S.L.; Address1: C/Baza, Parcela 19, Nave 3; Address2: Polígono Ind. Juncaril; Address3: 18210-Peligros-Granada; Address4: Spain; Revision: 3.4; SheetNumber: 6; SheetTotal: 23; WebAddress: www.sevensols.com; Project: White Rabbit; ProjectName: Project Name
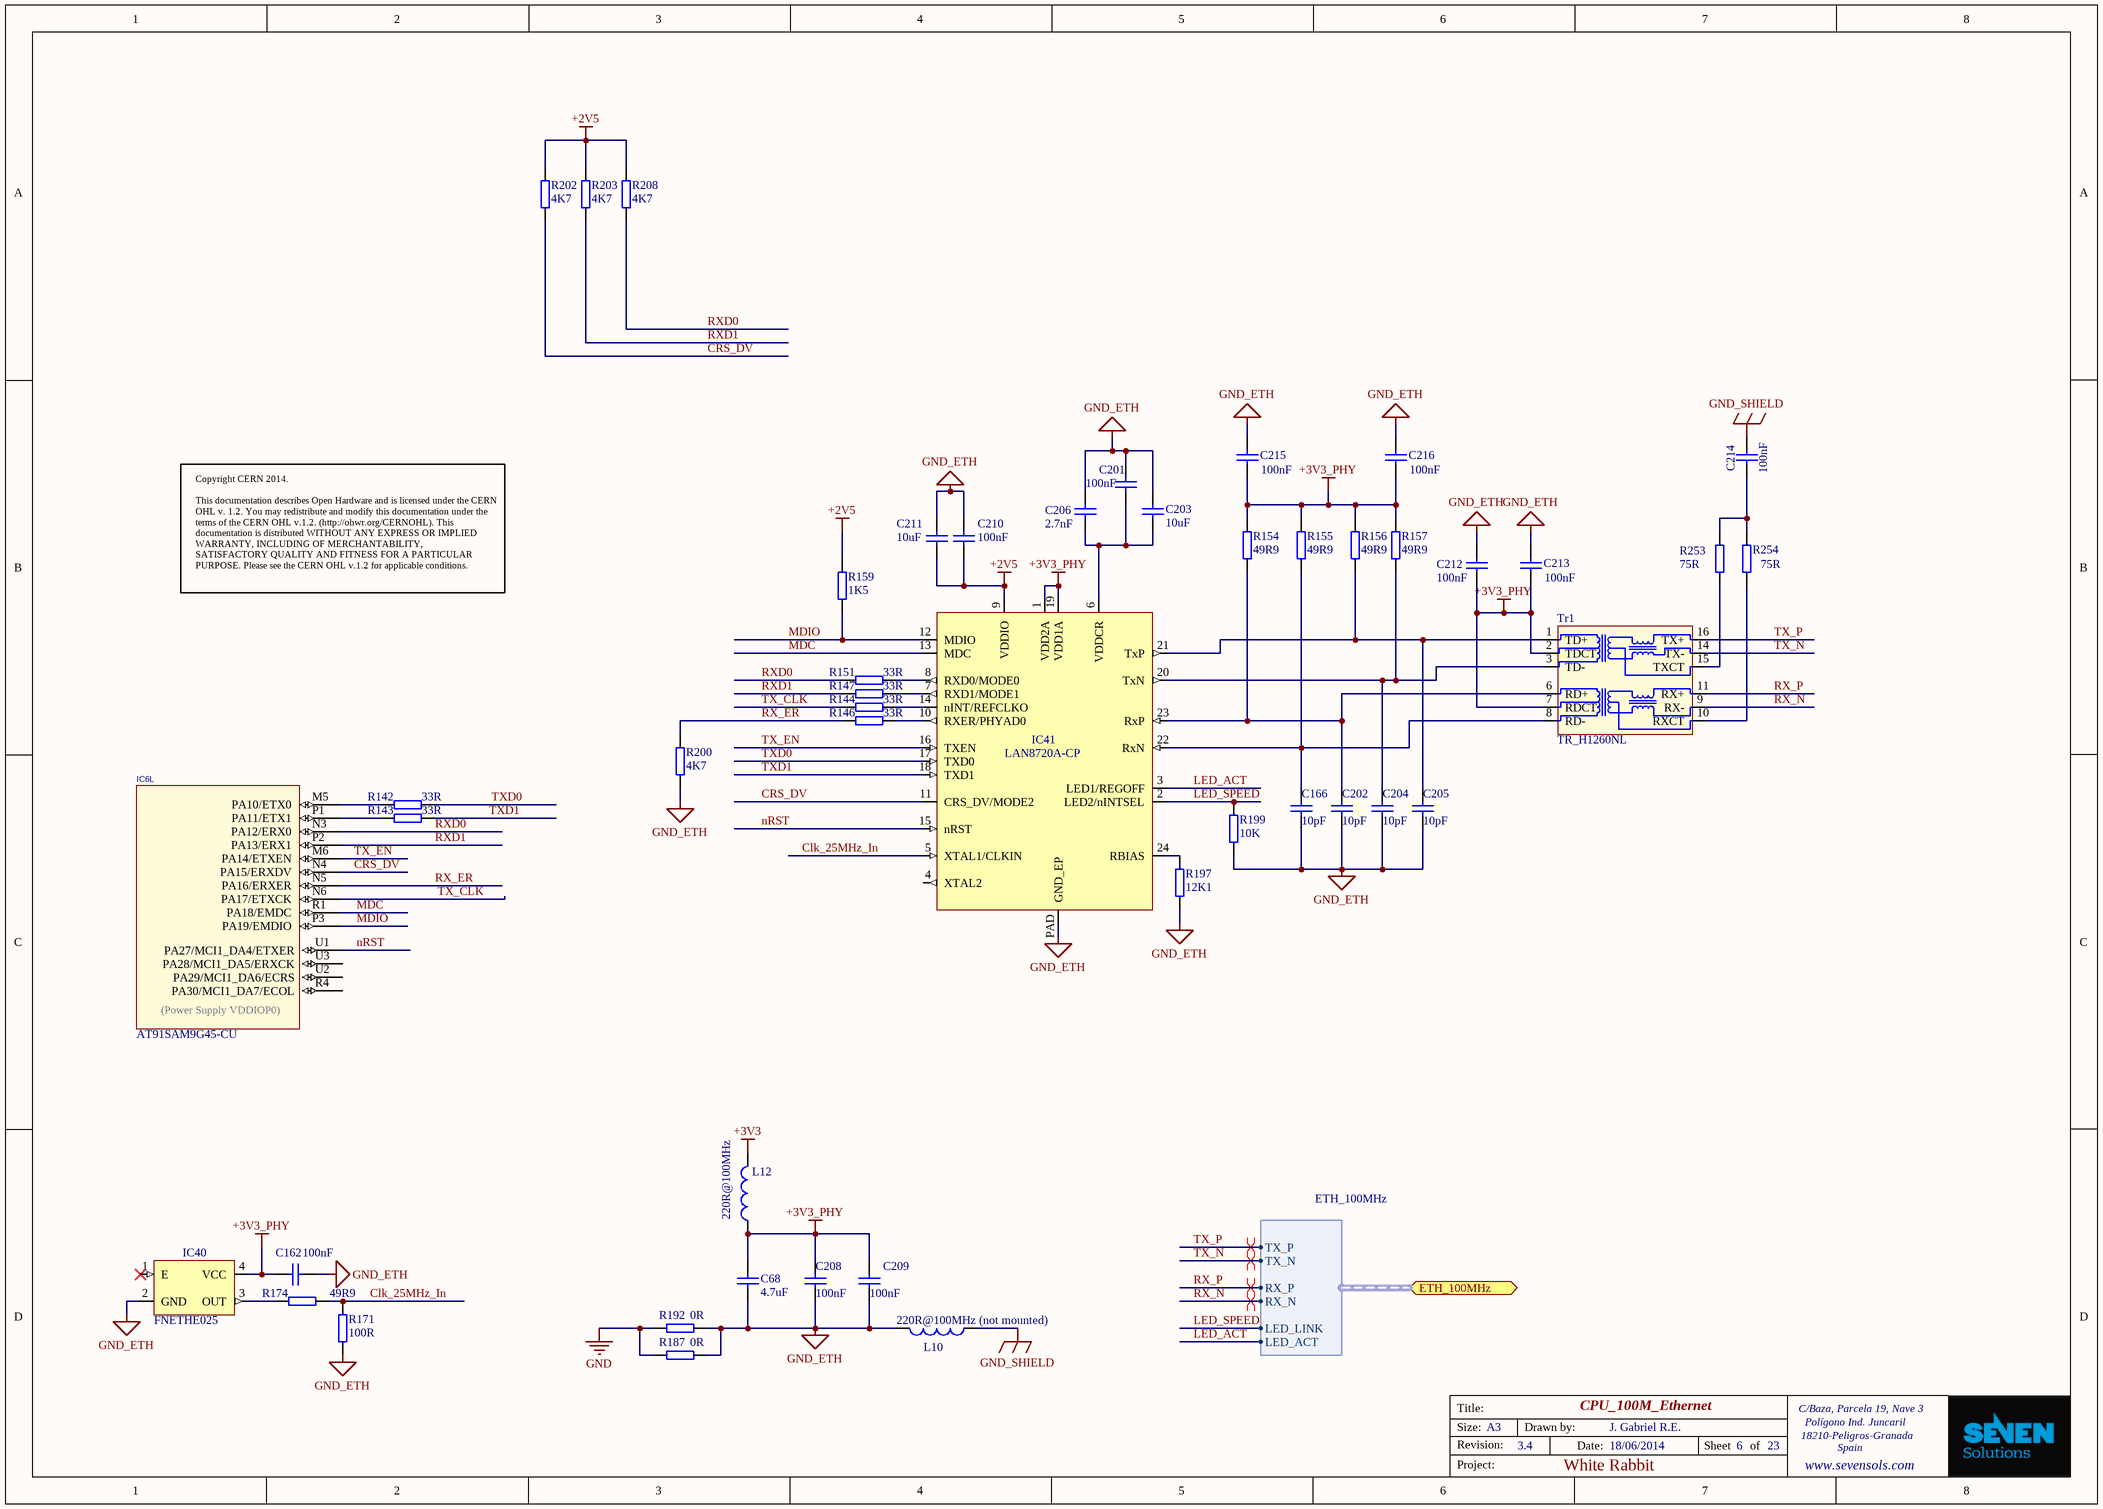
[diagram p7: CPU_100M_Ethernet.SchDoc]

### Parts
C68  4.7uF  [CC1608-0603]
C162  100nF  [CC1005-0402]
C166  10pF  [CC1005-0402]
C201  100nF  [CC1005-0402]
C202  10pF  [CC1005-0402]
C203  10uF  [CC1608-0603]
C204  10pF  [CC1005-0402]
C205  10pF  [CC1005-0402]
C206  2.7nF  [CC1005-0402]
C208  100nF  [CC1005-0402]
C209  100nF  [CC1005-0402]
C210  100nF  [CC1005-0402]
C211  10uF  [CC1608-0603]
C212  100nF  [CC1005-0402]
C213  100nF  [CC1005-0402]
C214  100nF  [CAPR500-250X720X650]
C215  100nF  [CC1005-0402]
C216  100nF  [CC1005-0402]
IC6  AT91SAM9G45-CU  [TFBGA324]  (part L of 12)
IC40  FNETHE025  [SPXO]
IC41  LAN8720A-CP  [QFN50P400X400-24W4M]
L10  Impedance: 220R@100MHz (not mounted)  [0603]  (hidden comment: 220R@100MHz Ferrite Bead)
L12  Impedance: 220R@100MHz  [0603]  (hidden comment: 220R@100MHz Ferrite Bead)
R142  33R  [0402]
R143  33R  [0402]
R144  33R  [0402]
R146  33R  [0402]
R147  33R  [0402]
R151  33R  [0402]
R154  49R9  [0603]
R155  49R9  [0603]
R156  49R9  [0603]
R157  49R9  [0603]
R159  1K5  [0402]
R171  100R  [0402]
R174  49R9  [0402]
R187  value 0R  [0402]  (hidden comment: Jumper)
R192  value 0R  [0402]  (hidden comment: Jumper)
R197  12K1  [0402]
R199  10k  [0402]
R200  4K7  [0402]
R202  4K7  [0402]
R203  4K7  [0402]
R208  4K7  [0402]
R253  75R  [0402]
R254  75R  [0402]
Tr1  TR_H1260NL  [H1260NL]

### Ports
ETH_100MHz (harness ETH_100MHz)

### Harnesses
ETH_100MHz: RX_P, TX_P, TX_N, RX_N, LED_LINK, LED_ACT

### Nets
+2V5: C210.2 C211.2 IC41.9(VDDIO) R159.2 R202.2 R203.2 R208.2
+3V3: L12.2
+3V3_PHY: C68.2 C162.2 C208.1 C209.1 C212.1 C213.1 C215.1 C216.1 IC40.4(VCC) IC41.1(VDD2A) IC41.19(VDD1A) L12.1 R154.2 R155.2 R156.2 R157.2 Tr1.2(TDCT) Tr1.7(RDCT)
GND: R187.2 R192.2
GND_ETH: C68.1 C162.1 C166.1 C201.1 C202.1 C203.1 C204.1 C205.1 C206.1 C208.2 C209.2 C210.1 C211.1 C212.2 C213.2 C215.2 C216.2 IC40.2(GND) IC41.PAD(GND_EP) L10.2 R171.1 R187.1 R192.1 R197.2 R199.1 R200.2
GND_SHIELD: C214.2 L10.1
Clk_25MHz_In: IC41.5(XTAL1/CLKIN) R171.2 R174.1
CRS_DV: IC6.N4(PA15/ERXDV) IC41.11(CRS_DV/MODE2) R202.1
LED_ACT: IC41.3(LED1/REGOFF) ; port ETH_100MHz.LED_ACT  [project net ETH_100MHz.LED_ACT]
LED_SPEED: IC41.2(LED2/nINTSEL) R199.2 ; port ETH_100MHz.LED_LINK  [project net ETH_100MHz.LED_LINK]
MDC: IC6.R1(PA18/EMDC) IC41.13(MDC)
MDIO: IC6.P3(PA19/EMDIO) IC41.12(MDIO) R159.1
nRST: IC6.U1(PA27/MCI1_DA4/ETXER) IC41.15(nRST)
RX_ER: IC6.N5(PA16/ERXER) R146.1 R200.1
RX_N: Tr1.9(RX-) ; port ETH_100MHz.RX_N  [project net ETH_100MHz.RX_N]
RX_P: Tr1.11(RX+) ; port ETH_100MHz.RX_P  [project net ETH_100MHz.RX_P]
RXD0: IC6.N3(PA12/ERX0) R151.1 R208.1
RXD1: IC6.P2(PA13/ERX1) R147.1 R203.1
TX_CLK: IC6.N6(PA17/ETXCK) R144.1
TX_EN: IC6.M6(PA14/ETXEN) IC41.16(TXEN)
TX_N: Tr1.14(TX-) ; port ETH_100MHz.TX_N  [project net ETH_100MHz.TX_N]
TX_P: Tr1.16(TX+) ; port ETH_100MHz.TX_P  [project net ETH_100MHz.TX_P]
TXD0: IC41.17(TXD0) R142.2
TXD1: IC41.18(TXD1) R143.2
NetC166_2: C166.2 IC41.22(RxN) R155.1 Tr1.8(RD-)
NetC201_2: C201.2 C203.2 C206.2 IC41.6(VDDCR)
NetC202_2: C202.2 IC41.23(RxP) R154.1 Tr1.6(RD+)
NetC204_2: C204.2 IC41.20(TxN) R157.1 Tr1.3(TD-)
NetC205_2: C205.2 IC41.21(TxP) R156.1 Tr1.1(TD+)
NetC214_1: C214.1 R253.2 R254.2
NetIC6_M5: IC6.M5(PA10/ETX0) R142.1
NetIC6_P1: IC6.P1(PA11/ETX1) R143.1
NetIC40_3: IC40.3(OUT) R174.2
NetIC41_7: IC41.7(RXD1/MODE1) R147.2
NetIC41_8: IC41.8(RXD0/MODE0) R151.2
NetIC41_10: IC41.10(RXER/PHYAD0) R146.2
NetIC41_14: IC41.14(nINT/REFCLKO) R144.2
NetIC41_24: IC41.24(RBIAS) R197.1
NetR253_1: R253.1 Tr1.15(TXCT)
NetR254_1: R254.1 Tr1.10(RXCT)

Not connected (* = marked no-connect by the designer): IC6 R4(PA30/MCI1_DA7/ECOL) U2(PA29/MCI1_DA6/ECRS) U3(PA28/MCI1_DA5/ERXCK); IC40 1(E)*; IC41 4(XTAL2)

### Layout directives
differential pair: ETH_100MHz.RX_N, ETH_100MHz.RX_P, ETH_100MHz.TX_N, ETH_100MHz.TX_P

### Notes on the sheet
- Copyright CERN 2014.
  This documentation describes Open Hardware and is licensed under the CERN OHL v. 1.2. You may redistribute and modify this documentation under the terms of the CERN OHL v.1.2. (http://ohwr.org/CERNOHL). This documentation is distributed WITHOUT ANY EXPRESS OR IMPLIED WARRANTY, INCLUDING OF MERCHANTABILITY, SATISFACTORY QUALITY AND FITNESS FOR A PARTICULAR PURPOSE. Please see the CERN OHL v.1.2 for applicable conditions.
- Title:
- Size:
- Revision:
- A3
- Drawn by:
- Date:
- Sheet
- of
- Project:
- (in symbol AT91SAM9G45-CU, part L) (Power Supply VDDIOP0)

### Library data of the parts
C68 = CC0603_4.7UF_10V_10%_X5R: as C91-C96 on sheet FPGA_GTX; Published: 8-Jun-2000; LatestRevisionDate: 17-Jul-2002; LatestRevisionNote: Re-released for DXP Platform.; PackageReference: RAD-0.3; Publisher: Altium Limited; Distributor1: Digikey; Distributor1 PN: 445-5170-1-ND; Case: 0603; Value: 4.7uF
C162 C201 C208-C210 C212 C213 C215 C216 = CC0402_100NF_16V_10%_X7R: as C29-C31 on sheet SCB_CLKs; Published: 8-Jun-2000; LatestRevisionDate: 17-Jul-2002; LatestRevisionNote: Re-released for DXP Platform.; PackageReference: RAD-0.3; Publisher: Altium Limited; Distributor1: Digikey; Distributor1 PN: 445-4952-1-ND; Case: 0402; Value: 100nF
C166 C202 C204 C205 = CC0402_10PF_50V_5%_NP0: Capacitor; Manufacturer1: TDK; Manufacturer1 PN: C1005C0G1H100D; TC: NPO; Tolerance: ±10%; Voltage: 50V; Published: 8-Jun-2000; LatestRevisionDate: 17-Jul-2002; LatestRevisionNote: Re-released for DXP Platform.; PackageReference: RAD-0.3; Publisher: Altium Limited; Distributor1: Digikey; Distributor1 PN: 445-1235-1-ND; Case: 0402; Value: 10pF
C203 C211 = CC0603_10UF_6.3V_20%_X5R: as C35 on sheet SCB_CLKs; Published: 8-Jun-2000; LatestRevisionDate: 17-Jul-2002; LatestRevisionNote: Re-released for DXP Platform.; PackageReference: RAD-0.3; Publisher: Altium Limited; Distributor1: Digikey; Distributor1 PN: 445-4112-1-ND; Case: 0603; Value: 10uF
C206 = CC0402_2.7NF_50V_10%_X7R: Capacitor; Manufacturer1: Panasonic; Manufacturer1 PN: ECJ-0EB1H272K; TC: X7R; Tolerance: ±10%; Voltage: 50V; Published: 8-Jun-2000; LatestRevisionDate: 17-Jul-2002; LatestRevisionNote: Re-released for DXP Platform.; PackageReference: RAD-0.3; Publisher: Altium Limited; Distributor1: Digikey; Distributor1 PN: PCC1726CT-ND; Case: 0402; Value: 2.7nF
C214 = CPER_100NF_100V_10%_500-250X720X650: Non-polarised capacitor; Part Description: Metallized Polyester Film Capacitor (MKT); Manufacturer: EPCOS; Manufacturer Part Number: B32529C1104K000; Voltage: 100VDC/63VAC; Tolerance: ±10%; Table: Capacitors THD; Part Number: CPER_100NF_100V_10%_500-250X720X650; Component Kind: Standard; Component Type: Standard; Pin Count: 2; Value: 100nF; Status: None; Case: LS5 W2.5 x L7.2 x H6.5; Mounted: Yes; Socket: No; SMD: No; ComponentHeight: 6.5mm; HelpURL: \\cern.ch\dfs\Applications\Altium\Datasheets\CPER_EPCOS_B32529.pdf; Author: CERN DEM JLC; CreateDate: 3/22/2010; LatestRevisionDate: 3/22/2010
IC6 = AT91SAM9G45-CU: Atmel 400MHz ARM926 MCU; Value: AT91SAM9G45-CU; Distributor1 PN: AT91SAM9G45-CU-ND; Distributor1: Digikey
IC40 = OSC_CFPS-73: SMD oscillator 3.3V (Elfa); Value: FNETHE025; Distributor: Digikey; Distributor PN: FNETHE025CT-ND
IC41 = LAN8720A-CP: RMII ethernet transceiver with auto MIDIX; Manufacturer: SMSC; Value: LAN8720A-CP; Distributor1: Digikey; Distributor1 PN: 638-1080-ND
L10 = L_FERRITE_BEAD: ferrite bead; Manufacturer1: Murata; Manufacturer1 PN: BLM18KG221SN1D; Current Rating: 2.2A; DCR: 50mOhm; Mounted: No; Case: 0603; Distributor1: Digikey; Distributor1 PN: 490-5255-1-ND
L12 = L_FERRITE_BEAD: as L2 on sheet SCB_CLKs; Case: 0603; Distributor1: Digikey; Distributor1 PN: 490-5255-1-ND
R142-R144 R146 R147 R151 = R0402_33R_±1%_0.1W_100PPM: SMD Resistor; Manufacturer1: Panasonic; Manufacturer1 PN: ERJ-2RKF33R0X; TCR: 100ppm; Power Rating: 0.1W; Tolerance: ±1%; Case: 0402; Distributor1: DigiKey; Distributor1 PN: P33.0LCT-ND; Value: 33R
R154-R157 = R0603_49R9_±1%_0.25W_100PPM: as R40 on sheet SCB_CLKs; Case: 0603; Distributor1: DigiKey; Distributor1 PN: 541-49.9SCT-ND; Value: 49R9
R159 = R0402_1K5_±1%_0.1W_100PPM: SMD Resistor; Manufacturer1: Panasonic; Manufacturer1 PN: ERJ-2RKF1501X; TCR: 100ppm; Power Rating: 0.1W; Tolerance: ±1%; Case: 0402; Distributor1: DigiKey; Distributor1 PN: P1.50KLCT-ND; Value: 1K5
R171 = R0402_100R_±1%_0.1W_100PPM: as R29 on sheet SCB_CLKs; Case: 0402; Distributor1: DigiKey; Distributor1 PN: P100LCT-ND; Value: 100R
R174 = R0402_49R9_±1%_0.1W_100PPM: as R23 on sheet SCB_CLKs; Case: 0402; Distributor1: DigiKey; Distributor1 PN: P49.9LCT-ND; Value: 49R9
R187 R192 = R0402_0R_0.1W_JUMPER: as R28 on sheet SCB_CLKs; Case: 0402; Distributor1: DigiKey; Distributor1 PN: P0.0JCT-ND; Tolerance: Jumper
R197 = R0402_12K1_±1%_0.1W_100PPM: SMD Resistor; Manufacturer1: Panasonic; Manufacturer1 PN: ERJ-2RKF1212X; TCR: 100ppm; Power Rating: 0.1W; Tolerance: ±1%; Case: 0402; Distributor1: DigiKey; Distributor1 PN: P12.1KLCT-ND; Value: 12K1
R199 = R0402_10K_±1%_0.1W_100PPM: as R35 on sheet SCB_CLKs; Case: 0402; Distributor1: DigiKey; Distributor1 PN: P10.0KLCT-ND; Value: 10K
R200 R202 R203 R208 = R0402_4.7K_±1%_0.1W_100PPM: as R252 on sheet SCB_CLKs; Case: 0402; Distributor1: DigiKey; Distributor1 PN: ERJ-2RKF4701X; Value: 4K7
R253 R254 = R0402_75R_±1%_0.1W_100PPM: SMD Resistor; Manufacturer1: Panasonic; Manufacturer1 PN: ERJ-2RKF75R0X; TCR: 100ppm; Power Rating: 0.1W; Tolerance: ±1%; Case: 0402; Distributor1: DigiKey; Distributor1 PN: P75.0LCT-ND; Value: 75R
Tr1 = TR_H1260NL: ethernet trafo (TME); Value: H1260NL; Distributor1 PN: 553-1328-ND; Distributor1: Digikey

## Sheet SMI_Link_7-12.SchDoc: SMI_Link_7-12
size A4; Date: 18/06/2014; DrawnBy: J. Gabriel R.E.; Organization: Seven Solutions S.L.; Address1: C/Baza, Parcela 19, Nave 3; Address2: Polígono Ind. Juncaril; Address3: 18210-Peligros-Granada; Address4: Spain; Revision: 3.4; SheetNumber: 18; SheetTotal: 23; WebAddress: www.sevensols.com; Project: White Rabbit; ProjectName: White Rabbit
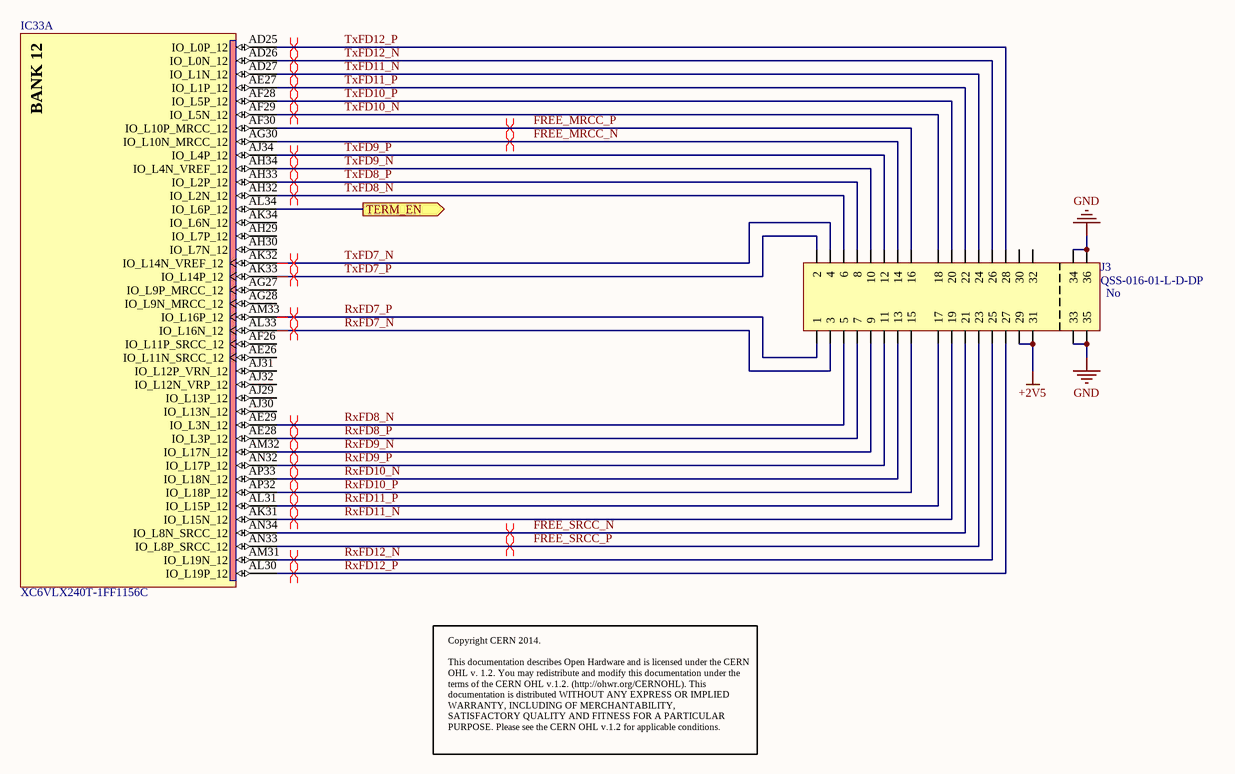
[diagram p8: SMI_Link_7-12.SchDoc]

### Parts
IC33  XC6VLX240T-1FF1156C  [FF1156]  (part A of 20)
J3  QSS-016-01-L-D-DP  Mounted: No  [QSS-016-01-X-D-DP-A]

### Ports
TERM_EN (out)

### Nets
+2V5: J3.29 J3.31
GND: J3.33 J3.34 J3.35 J3.36
FREE_MRCC_N: IC33.AG30(IO_L10N_MRCC_12) J3.14
FREE_MRCC_P: IC33.AF30(IO_L10P_MRCC_12) J3.16
FREE_SRCC_N: IC33.AN34(IO_L8N_SRCC_12) J3.21
FREE_SRCC_P: IC33.AN33(IO_L8P_SRCC_12) J3.23
RxFD7_N: IC33.AL33(IO_L16N_12) J3.3
RxFD7_P: IC33.AM33(IO_L16P_12) J3.1
RxFD8_N: IC33.AE29(IO_L3N_12) J3.5
RxFD8_P: IC33.AE28(IO_L3P_12) J3.7
RxFD9_N: IC33.AM32(IO_L17N_12) J3.9
RxFD9_P: IC33.AN32(IO_L17P_12) J3.11
RxFD10_N: IC33.AP33(IO_L18N_12) J3.13
RxFD10_P: IC33.AP32(IO_L18P_12) J3.15
RxFD11_N: IC33.AK31(IO_L15N_12) J3.19
RxFD11_P: IC33.AL31(IO_L15P_12) J3.17
RxFD12_N: IC33.AM31(IO_L19N_12) J3.25
RxFD12_P: IC33.AL30(IO_L19P_12) J3.27
TxFD7_N: IC33.AK32(IO_L14N_VREF_12) J3.4
TxFD7_P: IC33.AK33(IO_L14P_12) J3.2
TxFD8_N: IC33.AH32(IO_L2N_12) J3.6
TxFD8_P: IC33.AH33(IO_L2P_12) J3.8
TxFD9_N: IC33.AH34(IO_L4N_VREF_12) J3.10
TxFD9_P: IC33.AJ34(IO_L4P_12) J3.12
TxFD10_N: IC33.AF29(IO_L5N_12) J3.18
TxFD10_P: IC33.AF28(IO_L5P_12) J3.20
TxFD11_N: IC33.AD27(IO_L1N_12) J3.24
TxFD11_P: IC33.AE27(IO_L1P_12) J3.22
TxFD12_N: IC33.AD26(IO_L0N_12) J3.26
TxFD12_P: IC33.AD25(IO_L0P_12) J3.28
NetIC33_AL34: IC33.AL34(IO_L6P_12) ; port TERM_EN

Not connected (* = marked no-connect by the designer): IC33 AE26(IO_L11N_SRCC_12) AF26(IO_L11P_SRCC_12) AG27(IO_L9P_MRCC_12) AG28(IO_L9N_MRCC_12) AH29(IO_L7P_12) AH30(IO_L7N_12) AJ29(IO_L13P_12) AJ30(IO_L13N_12) AJ31(IO_L12P_VRN_12) AJ32(IO_L12N_VRP_12) AK34(IO_L6N_12); J3 30 32

### Layout directives
differential pair: FREE_MRCC_N, FREE_MRCC_P, FREE_SRCC_N, FREE_SRCC_P, RxFD7_N, RxFD7_P, RxFD8_N, RxFD8_P, RxFD9_N, RxFD9_P, RxFD10_N, RxFD10_P, RxFD11_N, RxFD11_P, RxFD12_N, RxFD12_P, TxFD7_N, TxFD7_P, TxFD8_N, TxFD8_P, TxFD9_N, TxFD9_P, TxFD10_N, TxFD10_P, TxFD11_N, TxFD11_P, TxFD12_N, TxFD12_P

### Notes on the sheet
- Copyright CERN 2014.
  This documentation describes Open Hardware and is licensed under the CERN OHL v. 1.2. You may redistribute and modify this documentation under the terms of the CERN OHL v.1.2. (http://ohwr.org/CERNOHL). This documentation is distributed WITHOUT ANY EXPRESS OR IMPLIED WARRANTY, INCLUDING OF MERCHANTABILITY, SATISFACTORY QUALITY AND FITNESS FOR A PARTICULAR PURPOSE. Please see the CERN OHL v.1.2 for applicable conditions.
- Title:
- Size:
- Revision:
- A4
- Drawn by:
- Date:
- Sheet
- of
- Project:
- (in symbol XC6VLX130T-1FF1156C, part A) BANK 12

### Library data of the parts
IC33 = XC6VLX130T-1FF1156C: as IC33 on sheet FPGA_GTX; FirstPublished: 17-Nov-2009; DatasheetVersion: v2.0, Sep-2009; PackageVersion: ver1.0, Jun-2009; PackageReference: FF1156; Publisher: Altium Limited; PackageDescription: 1156-Ball Flip-Chip Fine Pitch Ball Grid Array (FF1156); Code_JEDEC: MS-034-AAR-1; Code_IPC: BGA100P34X34-1156; ComponentLink1Description: Virtex-6 Datasheet; ComponentLink1URL: http://www.xilinx.com/support/documentation/data_sheets/ds150.pdf; ComponentLink2Description: Pinout Specification; ComponentLink2URL: http://www.xilinx.com/support/packagefiles/virtex-6-pkgs.htm; ComponentLink3Description: FF1156 Package Drawing; ComponentLink3URL: http://www.xilinx.com/support/documentation/package_specs/ff1156.pdf; ComponentLink4Description: Virtex-6 Documents; ComponentLink4URL: http://www.xilinx.com/support/documentation/virtex-6.htm; ComponentLink5Description: Xilinx.com Home; ComponentLink5URL: http://www.xilinx.com